# Altium project SCH-46441_A1.PrjPcb
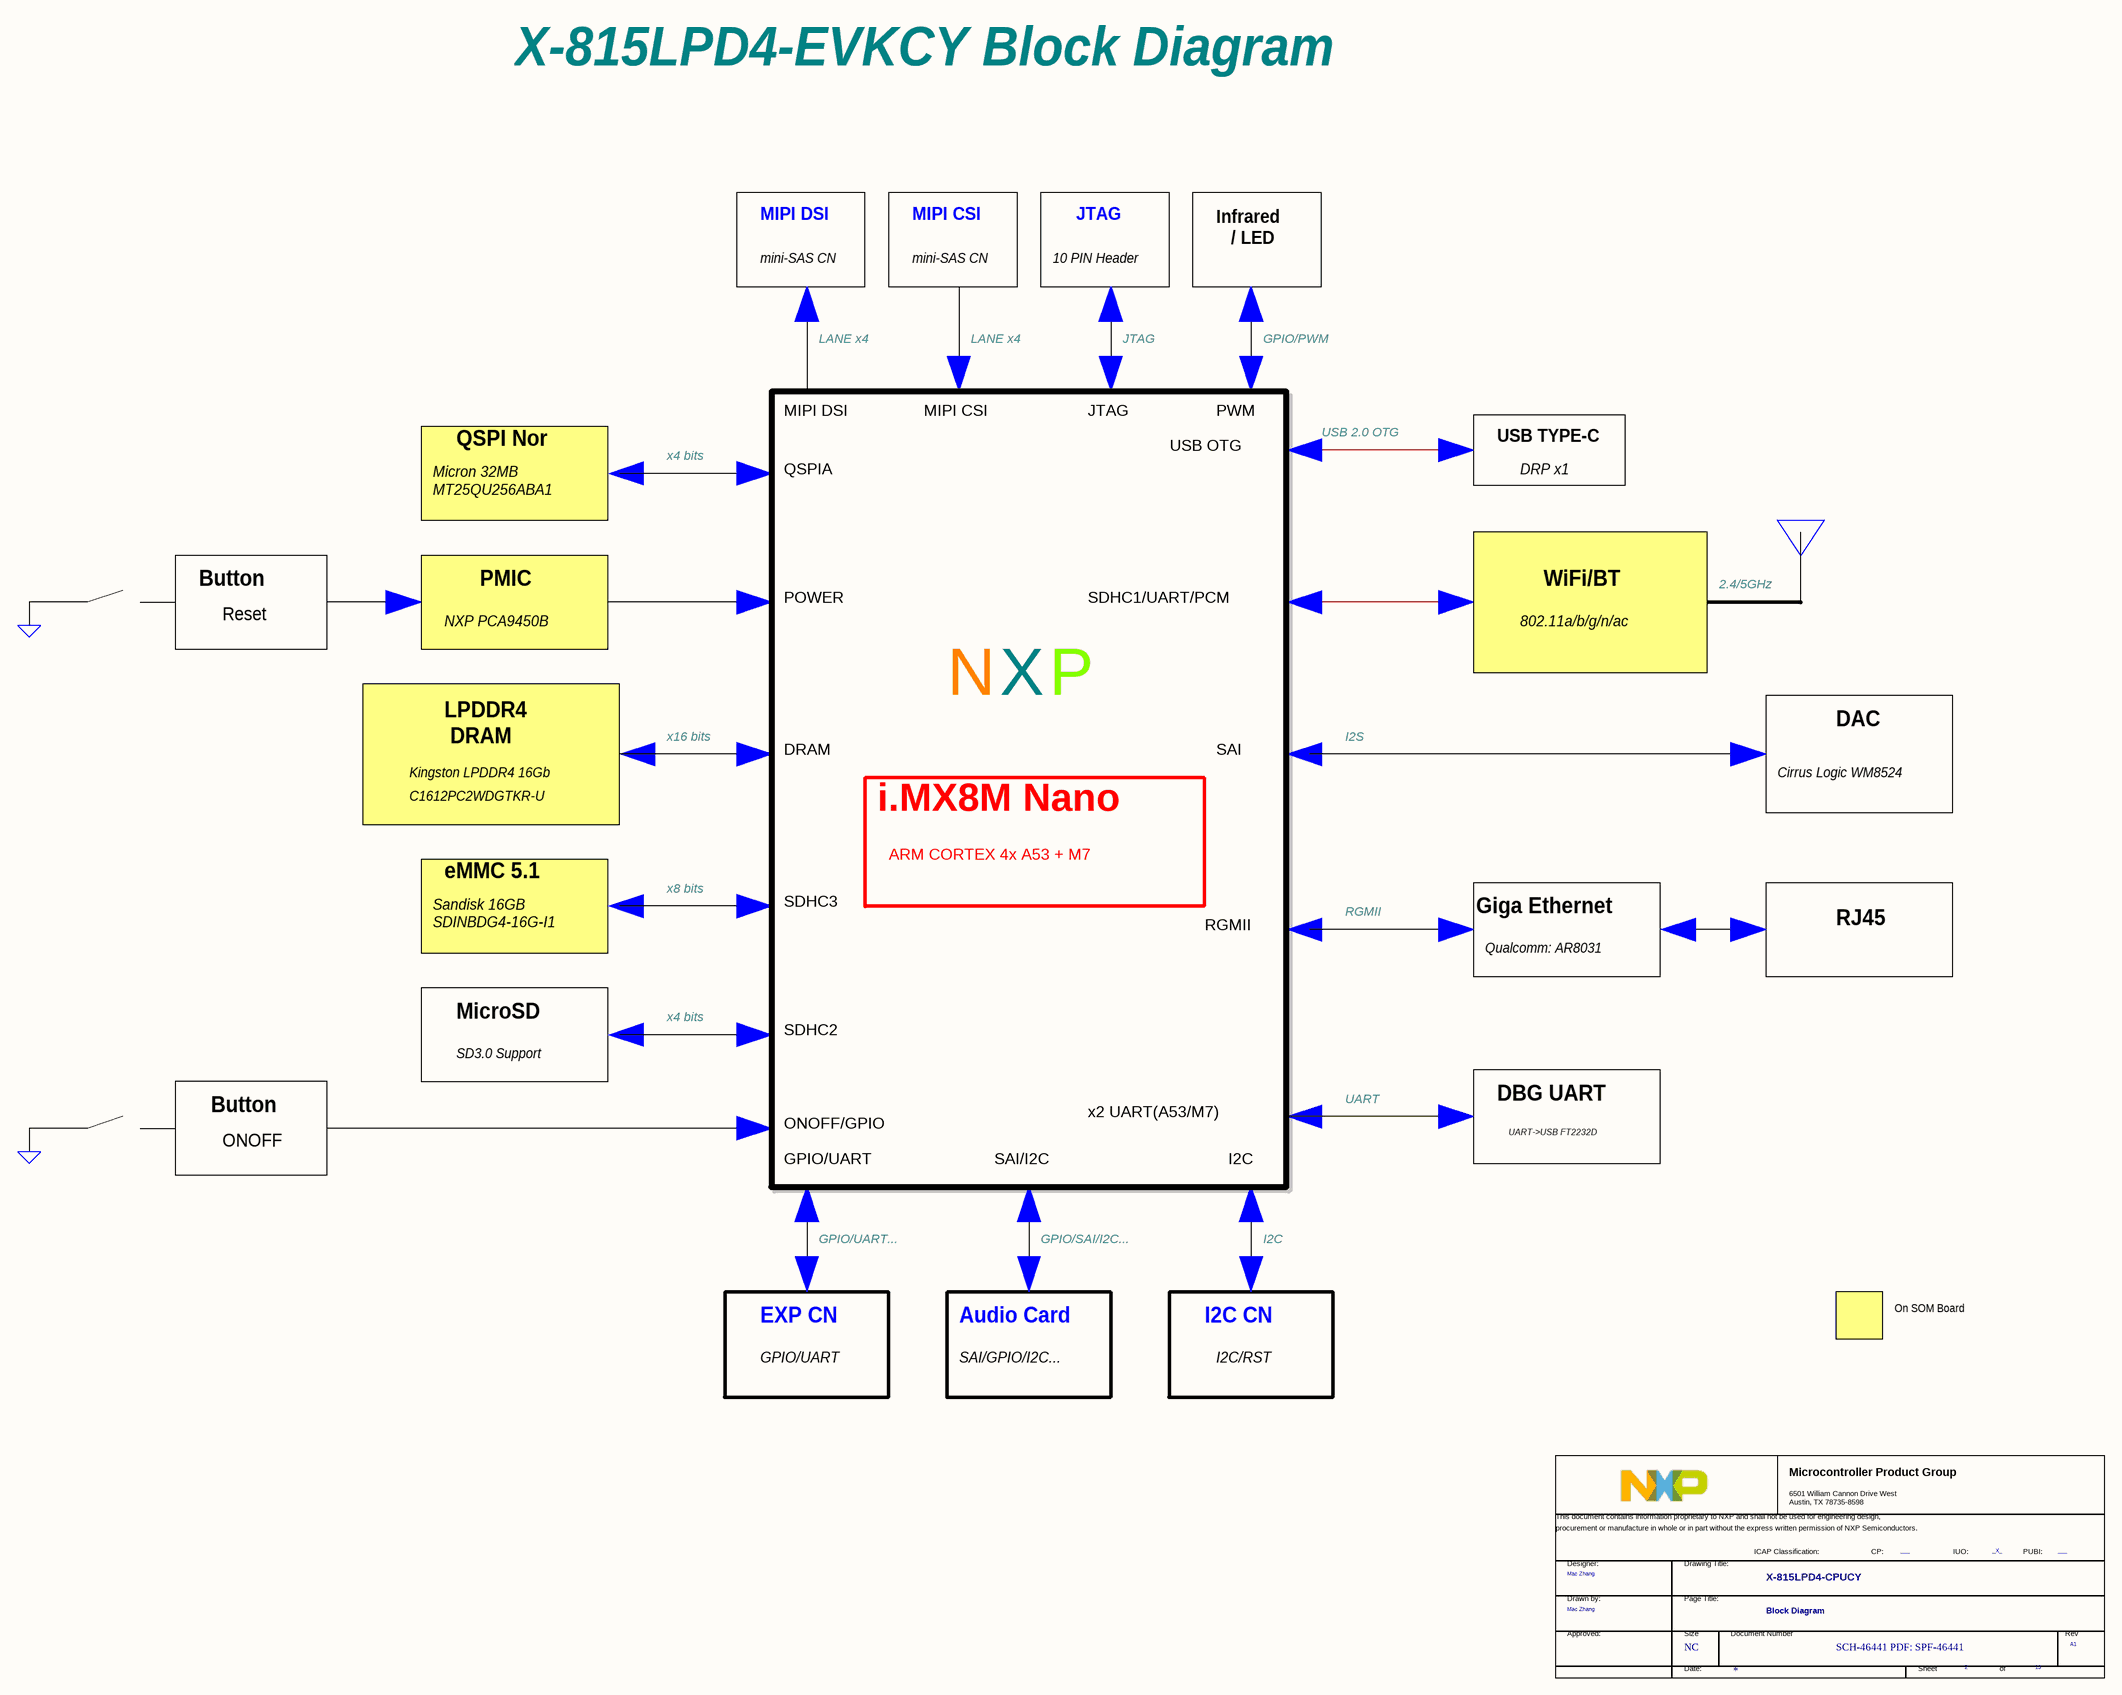
[diagram p0: Page02 BLOCK DIAGRAM.SchDoc]
5 sheets, 124 parts. Net scope: global (net labels, ports and power ports of the same name join across sheets).
Sheets:
  Page02 BLOCK DIAGRAM.SchDoc
  Page03 PWR TREE.SchDoc
  Page10 WIFI&Bluetooth.SchDoc
  Page12 PMIC PCA9450B.SchDoc
  Page09 eMMC_QSPI.SchDoc

## Sheet Page02 BLOCK DIAGRAM.SchDoc
size 513 x 386 mm

### Parts
(Parts that share a designator on the sheet are numbered #1, #2 ... from top to bottom, then left to right.)
*#1  Doc: SCH-46441 PDF: SPF-46441  RevCode: A1  Title: X-815LPD4-CPUCY  Page Size: NC  Page Number: 2  Page Count: 13  PageTitle: Block Diagram  Designer: Mac Zhang  PUBI: ___  FIUO: _X_  (hidden comment: TitleBlock_MCPG)  (graphical)

### Notes on the sheet
- X-815LPD4-EVKCY Block Diagram
- MIPI DSI
- MIPI CSI
- JTAG
- Infrared
  / LED
- mini-SAS CN
- 10 PIN Header
- LANE x4
- GPIO/PWM
- PWM
- QSPI Nor
- x4 bits
- QSPIA
- USB OTG
- USB 2.0 OTG
- USB TYPE-C
- DRP x1
- Micron 32MB
  MT25QU256ABA1
- Button
- PMIC
- WiFi/BT
- 2.4/5GHz
- Reset
- NXP PCA9450B
- POWER
- SDHC1/UART/PCM
- 802.11a/b/g/n/ac
- N
- X
- P
- Kingston LPDDR4 16Gb
- LPDDR4
  DRAM
- x16 bits
- DRAM
- SAI
- I2S
- Cirrus Logic WM8524
- DAC
- C1612PC2WDGTKR-U
- i.MX8M Nano
- eMMC 5.1
- x8 bits
- ARM CORTEX 4x A53 + M7
- Sandisk 16GB
  SDINBDG4-16G-I1
- SDHC3
- RGMII
- Giga Ethernet
- Qualcomm: AR8031
- RJ45
- SD3.0 Support
- MicroSD
- SDHC2
- ONOFF/GPIO
- x2 UART(A53/M7)
- UART
- DBG UART
- ONOFF
- GPIO/UART
- SAI/I2C
- I2C
- UART->USB FT2232D
- GPIO/UART...
- GPIO/SAI/I2C...
- EXP CN
- Audio Card
- SAI/GPIO/I2C...
- I2C CN
- I2C/RST
- On SOM Board
- (in symbol TitleBlock_MCPG) Microcontroller Product Group; 6501 William Cannon Drive West / Austin, TX 78735-8598; This document contains information proprietary to NXP and shall not be used for engineering design,; procurement or manufacture in whole or in part without the express written permission of NXP Semiconductors.; ICAP Classification:; CP:; IUO:; PUBI:; Designer:; Drawing Title:; Drawn by:; Page Title:; Approved:; Size; Document Number; Rev; Date:; Sheet; of

### Library data of the parts
*#1 = TitleBlock_MCPG: OrgAddr1: NO. 192 Liangjing Rd. Pudong New Area, ShangHai; OrgName: NXP Semiconductor; Page Create Date: March  8, 1995; DrawnBy: Mac Zhang; FCP: ___; Page Modify Date: *

## Sheet Page03 PWR TREE.SchDoc
size 513 x 386 mm
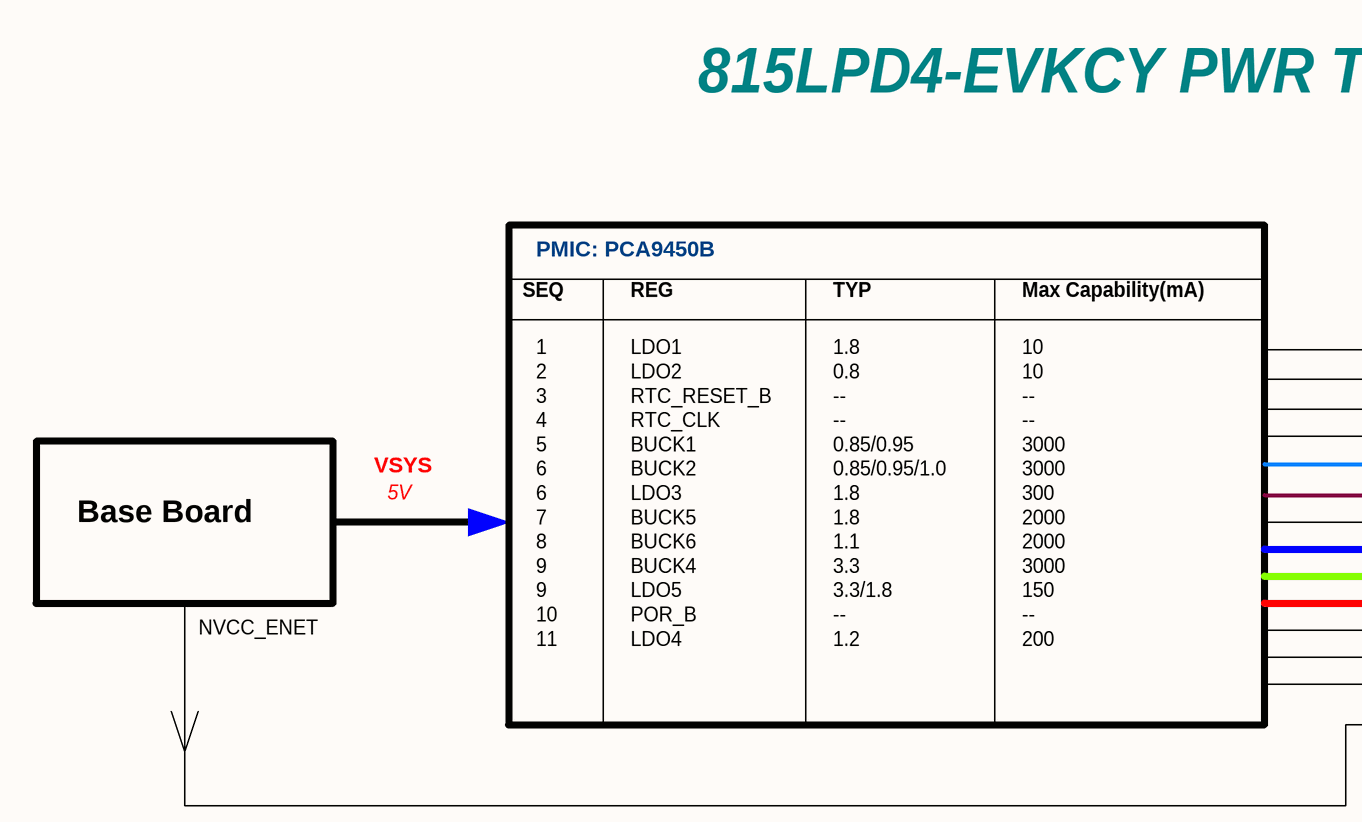
[diagram p1: Page03 PWR TREE.SchDoc, left]
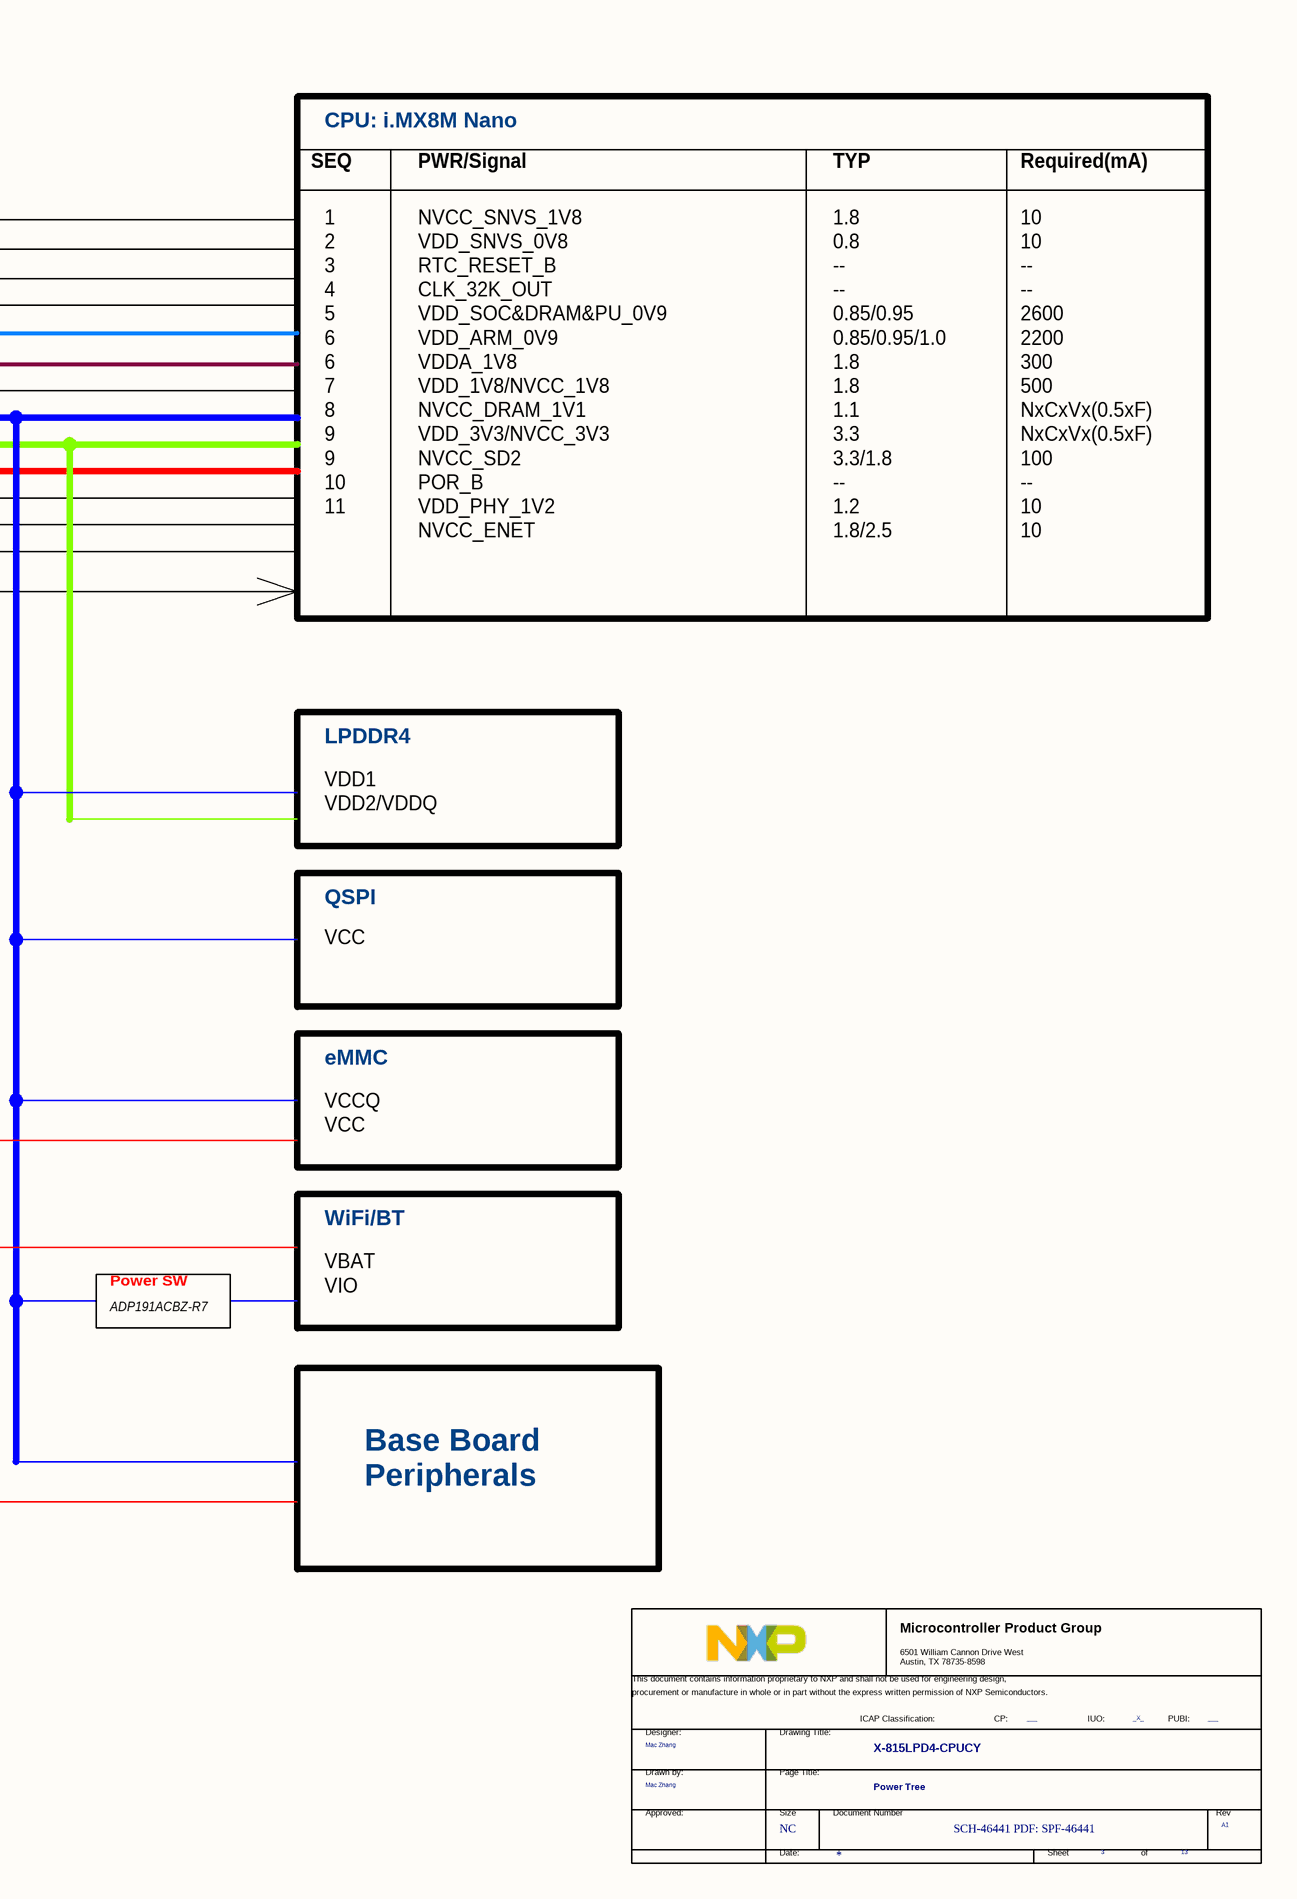
[diagram p2: Page03 PWR TREE.SchDoc, right]

### Parts
(Parts that share a designator on the sheet are numbered #1, #2 ... from top to bottom, then left to right.)
*#2  Doc: SCH-46441 PDF: SPF-46441  RevCode: A1  Title: X-815LPD4-CPUCY  Page Size: NC  Page Number: 3  Page Count: 13  PageTitle: Power Tree  Designer: Mac Zhang  PUBI: ___  FIUO: _X_  (hidden comment: TitleBlock_MCPG)  (graphical)

### Notes on the sheet
- 815LPD4-EVKCY PWR TREE
- PMIC: PCA9450B
- CPU: i.MX8M Nano
- SEQ
- REG
- TYP
- Max Capability(mA)
- PWR/Signal
- Required(mA)
- VSYS
- Base Board
- 5V
- NVCC_ENET
- 1
  2
  3
  4
  5
  6
  6
  7
  8
  9
  9
  10
  11
- LDO1
  LDO2
  RTC_RESET_B
  RTC_CLK
  BUCK1
  BUCK2
  LDO3
  BUCK5
  BUCK6
  BUCK4
  LDO5
  POR_B
  LDO4
- 1.8
  0.8
  --
  --
  0.85/0.95
  0.85/0.95/1.0
  1.8
  1.8
  1.1
  3.3
  3.3/1.8
  --
  1.2
- 10
  10
  --
  --
  3000
  3000
  300
  2000
  2000
  3000
  150
  --
  200
- NVCC_SNVS_1V8
  VDD_SNVS_0V8
  RTC_RESET_B
  CLK_32K_OUT
  VDD_SOC&DRAM&PU_0V9
  VDD_ARM_0V9
  VDDA_1V8
  VDD_1V8/NVCC_1V8
  NVCC_DRAM_1V1
  VDD_3V3/NVCC_3V3
  NVCC_SD2
  POR_B
  VDD_PHY_1V2
  NVCC_ENET
- 1.8
  0.8
  --
  --
  0.85/0.95
  0.85/0.95/1.0
  1.8
  1.8
  1.1
  3.3
  3.3/1.8
  --
  1.2
  1.8/2.5
- 10
  10
  --
  --
  2600
  2200
  300
  500
  NxCxVx(0.5xF)
  NxCxVx(0.5xF)
  100
  --
  10
  10
- LPDDR4
- VDD1
  VDD2/VDDQ
- VCC
- QSPI
- eMMC
- VCCQ
  VCC
- WiFi/BT
- Power SW
- VBAT
  VIO
- ADP191ACBZ-R7
- Base Board
  Peripherals
- (in symbol TitleBlock_MCPG) Microcontroller Product Group; 6501 William Cannon Drive West / Austin, TX 78735-8598; This document contains information proprietary to NXP and shall not be used for engineering design,; procurement or manufacture in whole or in part without the express written permission of NXP Semiconductors.; ICAP Classification:; CP:; IUO:; PUBI:; Designer:; Drawing Title:; Drawn by:; Page Title:; Approved:; Size; Document Number; Rev; Date:; Sheet; of

### Library data of the parts
*#2 = TitleBlock_MCPG: OrgName: NXP Semiconductor; OrgAddr1: NO. 192 Liangjing Rd. Pudong New Area, ShangHai; Page Create Date: March  8, 1995; DrawnBy: Mac Zhang; FCP: ___; Page Modify Date: *

## Sheet Page10 WIFI&Bluetooth.SchDoc
size 386 x 246 mm
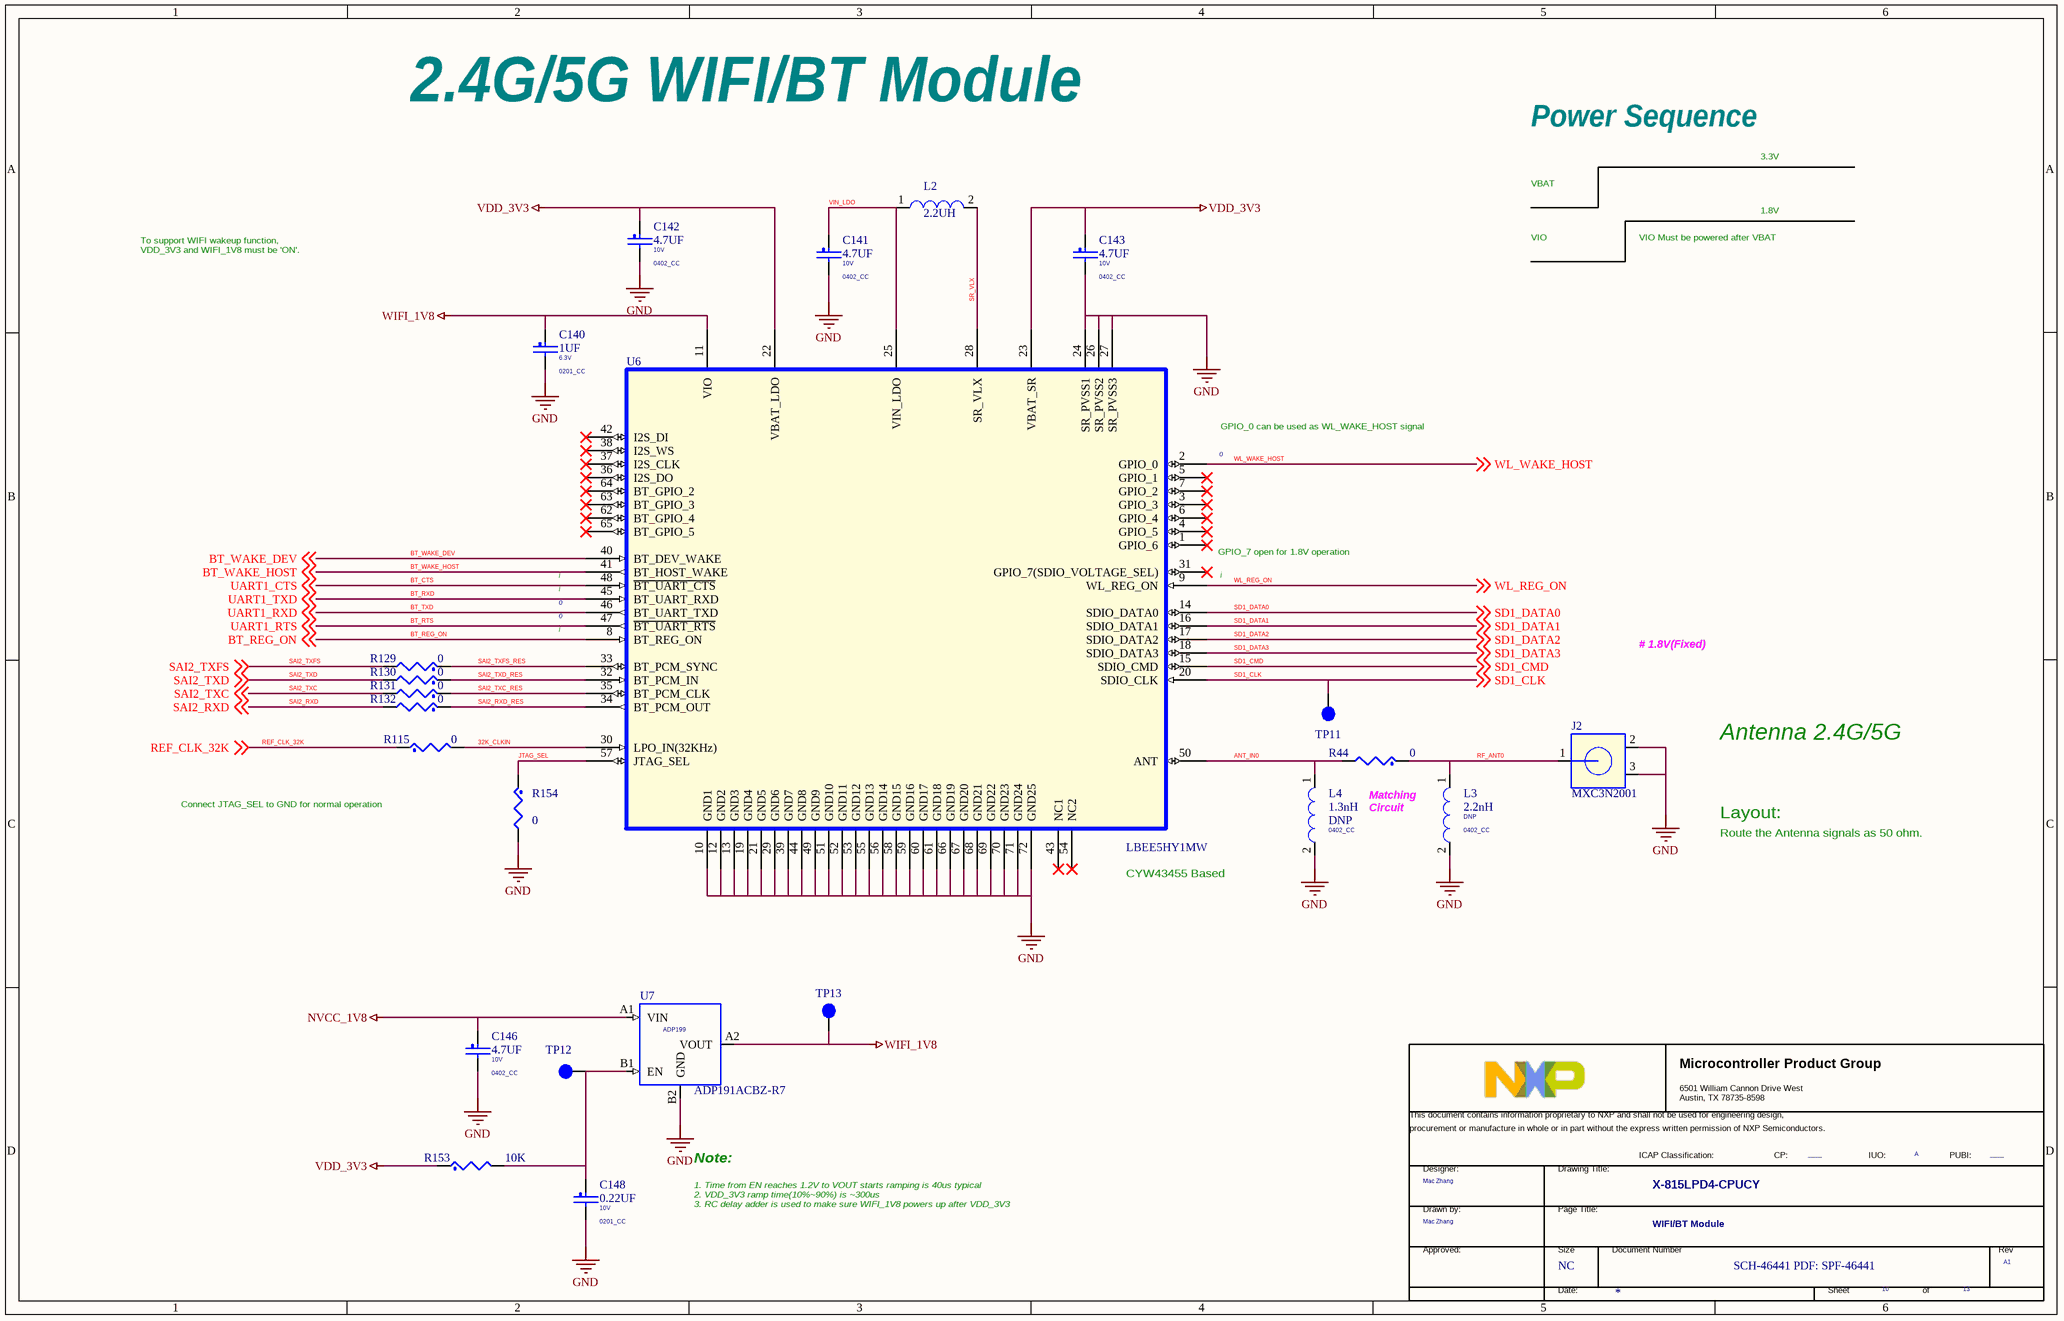
[diagram p3: Page10 WIFI&Bluetooth.SchDoc]

### Parts
(Parts that share a designator on the sheet are numbered #1, #2 ... from top to bottom, then left to right.)
*#3  Doc: SCH-46441 PDF: SPF-46441  RevCode: A1  Title: X-815LPD4-CPUCY  Page Size: NC  Page Number: 10  Page Count: 13  PageTitle: WIFI/BT Module  Designer: Mac Zhang  PUBI: ____  FIUO: A  (hidden comment: TitleBlock_MCPG)  (graphical)
C140  1UF  VOLTAGE: 6.3V  [0201_CC]
C141  4.7UF  VOLTAGE: 10V  [0402_CC]
C142  4.7UF  VOLTAGE: 10V  [0402_CC]
C143  4.7UF  VOLTAGE: 10V  [0402_CC]
C146  4.7UF  VOLTAGE: 10V  [0402_CC]
C148  0.22UF  VOLTAGE: 10V  [0201_CC]
J2  MXC3N2001  [CON_3_UFL_R_SMT]
L2  2.2UH  [IND_0603A]
L3  2.2nH  ASSY_OPT: DNP  [0402_CC]
L4  1.3nH  ASSY_OPT: DNP  [0402_CC]
R44  0  [0402_CC]
R115  0  [0402_CC]
R129  0  [0402_CC]
R130  0  [0402_CC]
R131  0  [0402_CC]
R132  0  [0402_CC]
R153  10K  [0201_CC]
R154  0  [0402_CC]
TP11  TPAD_015  [TPAD_015]  (value not drawn)
TP12  tpad_020  [tpad_020]  (value not drawn)
TP13  tpad_020  [tpad_020]  (value not drawn)
U6  LBEE5HY1MW  [lga72_0p5_7p9x7p3]
U7  ADP191ACBZ-R7  [wlcsp4_0p4_0p8x0p8_smdp]

### Nets
GND: C140.2 C141.2 C142.2 C143.2 C146.2 C148.2 J2.2(GND1) J2.3(GND2) L3.2 L4.2 R154.2 U6.10(GND1) U6.12(GND2) U6.13(GND3) U6.19(GND4) U6.21(GND5) U6.24(SR_PVSS1) U6.26(SR_PVSS2) U6.27(SR_PVSS3) U6.29(GND6) U6.39(GND7) U6.44(GND8) U6.49(GND9) U6.51(GND10) U6.52(GND11) U6.53(GND12) U6.55(GND13) U6.56(GND14) U6.58(GND15) U6.59(GND16) U6.60(GND17) U6.61(GND18) U6.66(GND19) U6.67(GND20) U6.68(GND21) U6.69(GND22) U6.70(GND23) U6.71(GND24) U6.72(GND25) U7.B2(GND)
NVCC_1V8: C146.1 U7.A1(VIN)
VDD_3V3: C142.1 C143.1 R153.1 U6.22(VBAT_LDO) U6.23(VBAT_SR)
WIFI_1V8: C140.1 TP13.1(Pin1) U6.11(VIO) U7.A2(VOUT)
32K_CLKIN: R115.2 U6.30(LPO_IN(32KHz))
ANT_IN0: L4.1 R44.2 U6.50(ANT)
BT_CTS: U6.48(~{BT_UART_CTS}) ; off-sheet UART1_CTS  [also labelled UART1_CTS]
BT_REG_ON: U6.8(BT_REG_ON) ; off-sheet BT_REG_ON
BT_RTS: U6.47(~{BT_UART_RTS}) ; off-sheet UART1_RTS  [also labelled UART1_RTS]
BT_RXD: U6.45(BT_UART_RXD) ; off-sheet UART1_TXD  [also labelled UART1_TXD]
BT_TXD: U6.46(BT_UART_TXD) ; off-sheet UART1_RXD  [also labelled UART1_RXD]
BT_WAKE_DEV: U6.40(BT_DEV_WAKE) ; off-sheet BT_WAKE_DEV
BT_WAKE_HOST: U6.41(BT_HOST_WAKE) ; off-sheet BT_WAKE_HOST
JTAG_SEL: R154.1 U6.57(JTAG_SEL)
REF_CLK_32K: R115.1 ; off-sheet REF_CLK_32K
RF_ANT0: J2.1(CTR) L3.1 R44.1
SAI2_RXD: R132.2 ; off-sheet SAI2_RXD
SAI2_RXD_RES: R132.1 U6.34(BT_PCM_OUT)
SAI2_TXC: R131.2 ; off-sheet SAI2_TXC
SAI2_TXC_RES: R131.1 U6.35(BT_PCM_CLK)
SAI2_TXD: R130.2 ; off-sheet SAI2_TXD
SAI2_TXD_RES: R130.1 U6.32(BT_PCM_IN)
SAI2_TXFS: R129.2 ; off-sheet SAI2_TXFS
SAI2_TXFS_RES: R129.1 U6.33(BT_PCM_SYNC)
SD1_CLK: TP11.1(Pin1) U6.20(SDIO_CLK) ; off-sheet SD1_CLK
SD1_CMD: U6.15(SDIO_CMD) ; off-sheet SD1_CMD
SD1_DATA0: U6.14(SDIO_DATA0) ; off-sheet SD1_DATA0
SD1_DATA1: U6.16(SDIO_DATA1) ; off-sheet SD1_DATA1
SD1_DATA2: U6.17(SDIO_DATA2) ; off-sheet SD1_DATA2
SD1_DATA3: U6.18(SDIO_DATA3) ; off-sheet SD1_DATA3
SR_VLX: L2.2 U6.28(SR_VLX)
VIN_LDO: C141.1 L2.1 U6.25(VIN_LDO)
WL_REG_ON: U6.9(WL_REG_ON) ; off-sheet WL_REG_ON
WL_WAKE_HOST: U6.2(GPIO_0) ; off-sheet WL_WAKE_HOST
NetC148_1: C148.1 R153.2 TP12.1(Pin1) U7.B1(EN)

Not connected (* = marked no-connect by the designer): U6 1(GPIO_6)* 3(GPIO_3)* 4(GPIO_5)* 5(GPIO_1)* 6(GPIO_4)* 7(GPIO_2)* 31(GPIO_7(SDIO_VOLTAGE_SEL))* 36(I2S_DO)* 37(I2S_CLK)* 38(I2S_WS)* 42(I2S_DI)* 43(NC1)* 54(NC2)* 62(BT_GPIO_4)* 63(BT_GPIO_3)* 64(BT_GPIO_2)* 65(BT_GPIO_5)*

### Notes on the sheet
- 2.4G/5G WIFI/BT Module
- VBAT
- Power Sequence
- 3.3V
- To support WIFI wakeup function,
  VDD_3V3 and WIFI_1V8 must be 'ON'.
- VIO
- VIO Must be powered after VBAT
- 1.8V
- (near U6) o
- GPIO_0 can be used as WL_WAKE_HOST signal
- i
- (near U6) GPIO_7 open for 1.8V operation
- o
- # 1.8V(Fixed)
- (near L3) Matching
  Circuit
- Antenna 2.4G/5G
- Layout:
- Connect JTAG_SEL to GND for normal operation
- Route the Antenna signals as 50 ohm.
- (near U6) CYW43455 Based
- 1. Time from EN reaches 1.2V to VOUT starts ramping is 40us typical
  2. VDD_3V3 ramp time(10%~90%) is ~300us
  3. RC delay adder is used to make sure WIFI_1V8 powers up after VDD_3V3
- Note:
- (in symbol ADP199_4P) ADP199
- (in symbol TitleBlock_MCPG) Microcontroller Product Group; 6501 William Cannon Drive West / Austin, TX 78735-8598; This document contains information proprietary to NXP and shall not be used for engineering design,; procurement or manufacture in whole or in part without the express written permission of NXP Semiconductors.; ICAP Classification:; CP:; IUO:; PUBI:; Designer:; Drawing Title:; Drawn by:; Page Title:; Approved:; Size; Document Number; Rev; Date:; Sheet; of

### Library data of the parts
*#3 = TitleBlock_MCPG: as *#2 on sheet Page03 PWR TREE; Page Create Date: March  8, 1995; DrawnBy: Mac Zhang; FCP: ____; Page Modify Date: *
C140 = CAP_NP: CAP CER 1uF 6.3V 20% X5R 0201; CLASS: DISCRETE; FPLIST: CC0201,CC0201_HD,0201_CC,0201_CC_012SM_NSP; CAD_APPROVED: Yes; MFG_PN01: 02016D105MAT2A; MFG_NAME01: AVX; AGILE_PN: 150-79407; HEIGHT: 0.35MM; ROHS: Yes; Tolerance: 20%; PCB Footprint: 0201_CC; Package Size: 0201; Package Type: 7¡± reel
C141-C143 C146 = CAP_NP: CAP CER 4.7uF 10V 10% X5R 0402; CLASS: DISCRETE; AGILE_PN: 150-80044; MFG_NAME01: Samsung Electro Mechanics; MFG_PN01: CL05A475KP5NRNC; CAD_APPROVED: Yes; FPLIST: CC0402_25,CC0402_HD,0402_CC; Tolerance: 10%; ROHS: Yes; HEIGHT: 0.65MM; PCB Footprint: 0402_CC
C148 = CAP_NP: CAP CER 0.22UF 10V 20% X5R 0201; CLASS: DISCRETE; AGILE_PN: 150-78815; MFG_NAME01: Taiyo Yuden; MFG_PN01: LMK063BJ224MP-F; CAD_APPROVED: Yes; FPLIST: CC0201,CC0201_HD,0201_CC; Tolerance: 20%; ROHS: Yes; HEIGHT: 0.33MM; PCB Footprint: 0201_CC
J2 = UFL: CON 1 COAX SKT SMT 55H AU; CLASS: IO; AGILE_PN: 211-79898; MFG_NAME01: SHENZHEN ATOM TECHNOLOGY CO.,LTD; CAD_APPROVED: Yes; MFG_PN01: MXC3N2001; ROHS: Yes; HEIGHT: 1.4MM; PCB Footprint: CON_3_UFL_R_SMT
L2 = INDUCTOR: IND -- 2.2UH@1MHZ 1.05A 20% 0603; CLASS: DISCRETE; AGILE_PN: 180-78587; MFG_NAME01: MURATA; MFG_PN01: LQM18PN2R2MGH; Temp_Range: -40C to + 85C; CAD_APPROVED: Yes; FPLIST: IND_0603A,0603_CC; PCB Footprint: IND_0603A; Tolerance: 20%; ROHS: Yes; HEIGHT: 1MM; PART_TYPE: INDUCTOR; Temp Range: -40C to + 85C
L3 = INDUCTOR: IND -- 0.0022UH@100MHZ 300MA 0.0003UH 0402; CLASS: DISCRETE; FPLIST: IND_0402,0402_CC; CAD_APPROVED: Yes; MFG_PN01: LQG15HS2N2S02D; MFG_NAME01: MURATA; AGILE_PN: 180-76426; PCB Footprint: 0402_CC; PART_TYPE: INDUCTOR; HEIGHT: 0.55mm; ROHS: Yes; Tolerance: 0.0003UH; Package Size: 0402
L4 = IND: IND FILM RF 1.3nH@500MHz  280mA 0.1nH 0402; PART_TYPE: INDUCTOR\0402; CLASS: DISCRETE; FPLIST: IND_0402,0402_CC; CAD_APPROVED: Yes; MFG_PN01: LQP15MN1N3B02D; MFG_NAME01: MURATA; AGILE_PN: 180-78445; PCB Footprint: 0402_CC; HEIGHT: 0.45MM; ROHS: Yes; Tolerance: 0.1nH; Package Size: 0402
R44 R115 = RES: RES MF ZERO OHM 1/16W 5% 0402; CLASS: DISCRETE; AGILE_PN: 470-75394; MFG_NAME01: ROHM; MFG_PN01: MCR01MZPJ000; CAD_APPROVED: Yes; HEIGHT: 0.45 MM; Tolerance: 5%; ROHS: Yes; PCB Footprint: 0402_CC; VOLTAGE: 1/16W
R129-R131 = RES: RES MF ZERO OHM 1/16W 5% 0402; CLASS: DISCRETE; AGILE_PN: 470-75394; MFG_NAME01: ROHM; MFG_PN01: MCR01MZPJ000; CAD_APPROVED: Yes; FPLIST: RC0402_25,RC0402_HD,RC0402_X2,0402_CC; TOL: 1%; SIGNAL_MODEL: DEFAULT_RESISTOR_10000OHM_2_1; PCB Footprint: 0402_CC; Tolerance: 5%; ROHS: Yes; HEIGHT: 0.45 MM; VOLTAGE: 1/16W
R132 R154 = RES: RES MF ZERO OHM 1/16W 5% 0402; CLASS: DISCRETE; SIGNAL_MODEL: DEFAULT_RESISTOR_10000OHM_2_1; TOL: 1%; FPLIST: RC0402_25,RC0402_HD,RC0402_X2,0402_CC; CAD_APPROVED: Yes; MFG_PN01: MCR01MZPJ000; MFG_NAME01: ROHM; AGILE_PN: 470-75394; PCB Footprint: 0402_CC; HEIGHT: 0.45 MM; ROHS: Yes; Tolerance: 5%; VOLTAGE: 1/16W
R153 = RES: RES MF 10K 1/20W 5% 0201; CLASS: DISCRETE; FPLIST: RC0201,0201_CC; CAD_APPROVED: Yes; MFG_PN01: RTT01103JTH; MFG_NAME01: RALEC ELECTRONIC CORP; AGILE_PN: 470-79719; HEIGHT: 0.26 MM; ROHS: Yes; Tolerance: 5%; PCB Footprint: 0201_CC
TP11 = TESTLOOP: TEST POINT PAD 15MIL DIA SMT, NO PART TO ORDER; CLASS: IO; ASSY_OPT: DNP; AGILE_PN: 211-76645; MFG_NAME01: NOTACOMPONENT; CAD_APPROVED: Yes; MFG_PN01: NOTACOMPONENT; ROHS: Yes; HEIGHT: 0.1MM; PCB Footprint: TPAD_015
TP12 TP13 = TESTLOOP: TEST POINT PAD 0.5MM DIA SMT, NO PART TO ORDER; CLASS: IO; CAD_APPROVED: Yes; AGILE_PN: 211-77484; HEIGHT: 0.1MM; ROHS: Yes; PCB Footprint: tpad_020
U6 = LBEE5HY1MW_LGA72: IC XCVR WIFI BLUETOOTH MODULE A/B/G/N/AC 1.71-3.46V LGA72; CAD_APPROVED: Yes; PRE_APN: 312-82117; MFG_PN01: LBEE5HY1MW-TEMP; MFG_NAME01: MURATA; AGILE_PN: TMP-WF-34457; CLASS: IC; PCB Footprint: lga72_0p5_7p9x7p3; HEIGHT: 1.1MM; ROHS: Yes
U7 = ADP199_4P: IC HIGH SIDE PWR SW 1.1-3.6V WLCSP4; AGILE_PN: 315-82028; MFG_NAME01: ANALOG DEVICES; Temp_Range: -45 to 85 C; CAD_APPROVED: Yes; CLASS: IC; PCB Footprint: wlcsp4_0p4_0p8x0p8_smdp; MFG_PN01: ADP191ACBZ-R7; ROHS: Yes; HEIGHT: 0.66MM; VOLTAGE: 1.1-3.6V; Temp Range: -45 to 85 C

## Sheet Page12 PMIC PCA9450B.SchDoc
size 513 x 386 mm
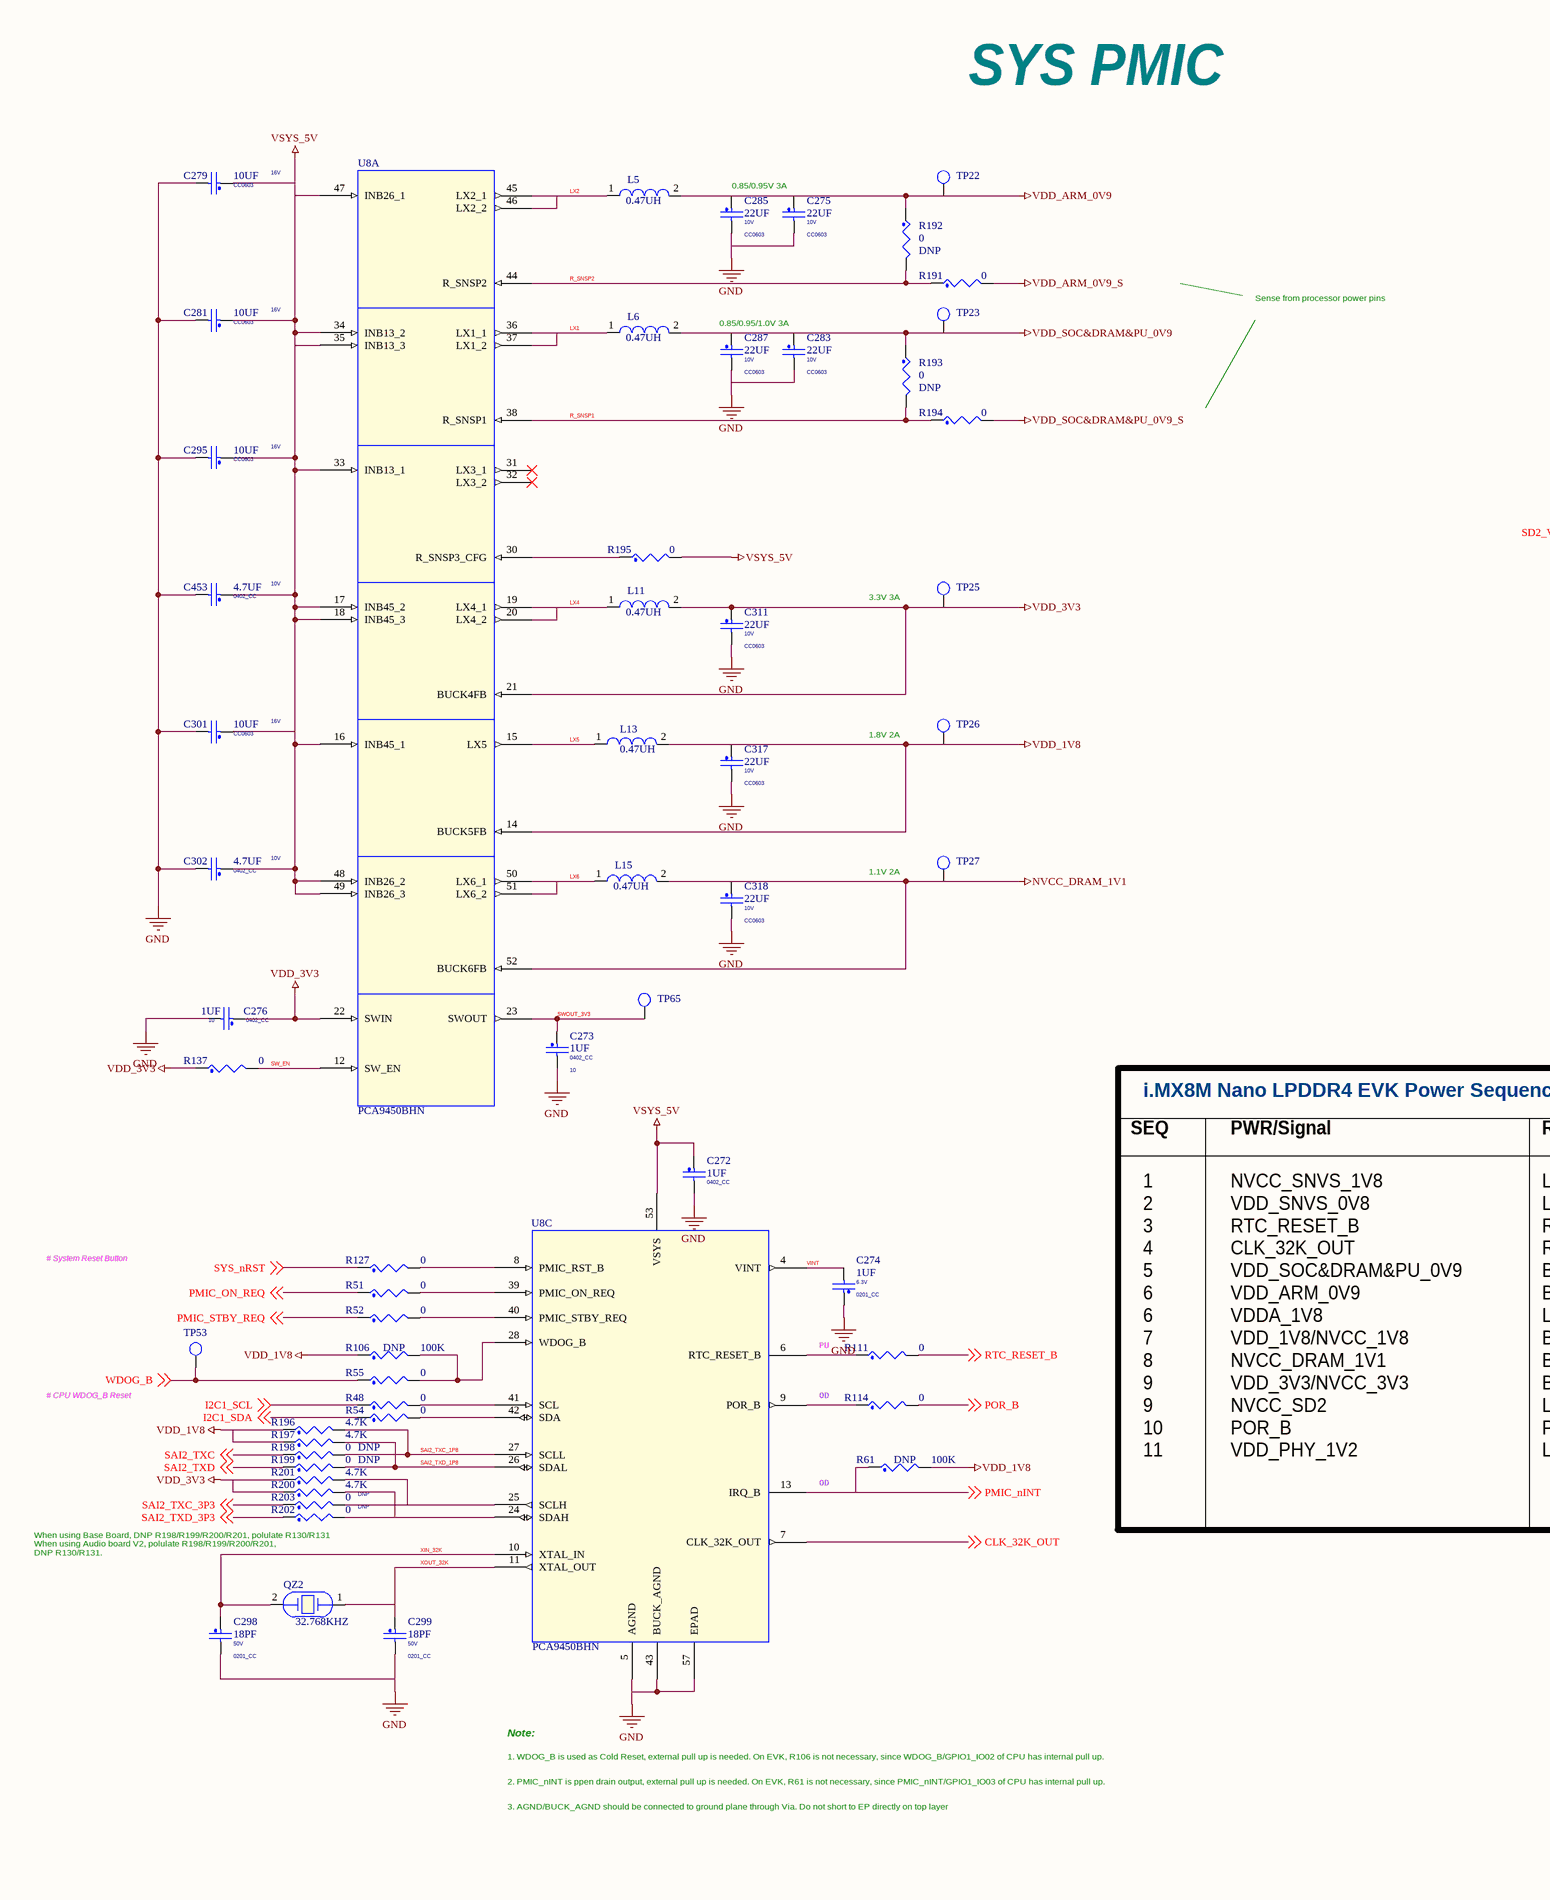
[diagram p4: Page12 PMIC PCA9450B.SchDoc, left]
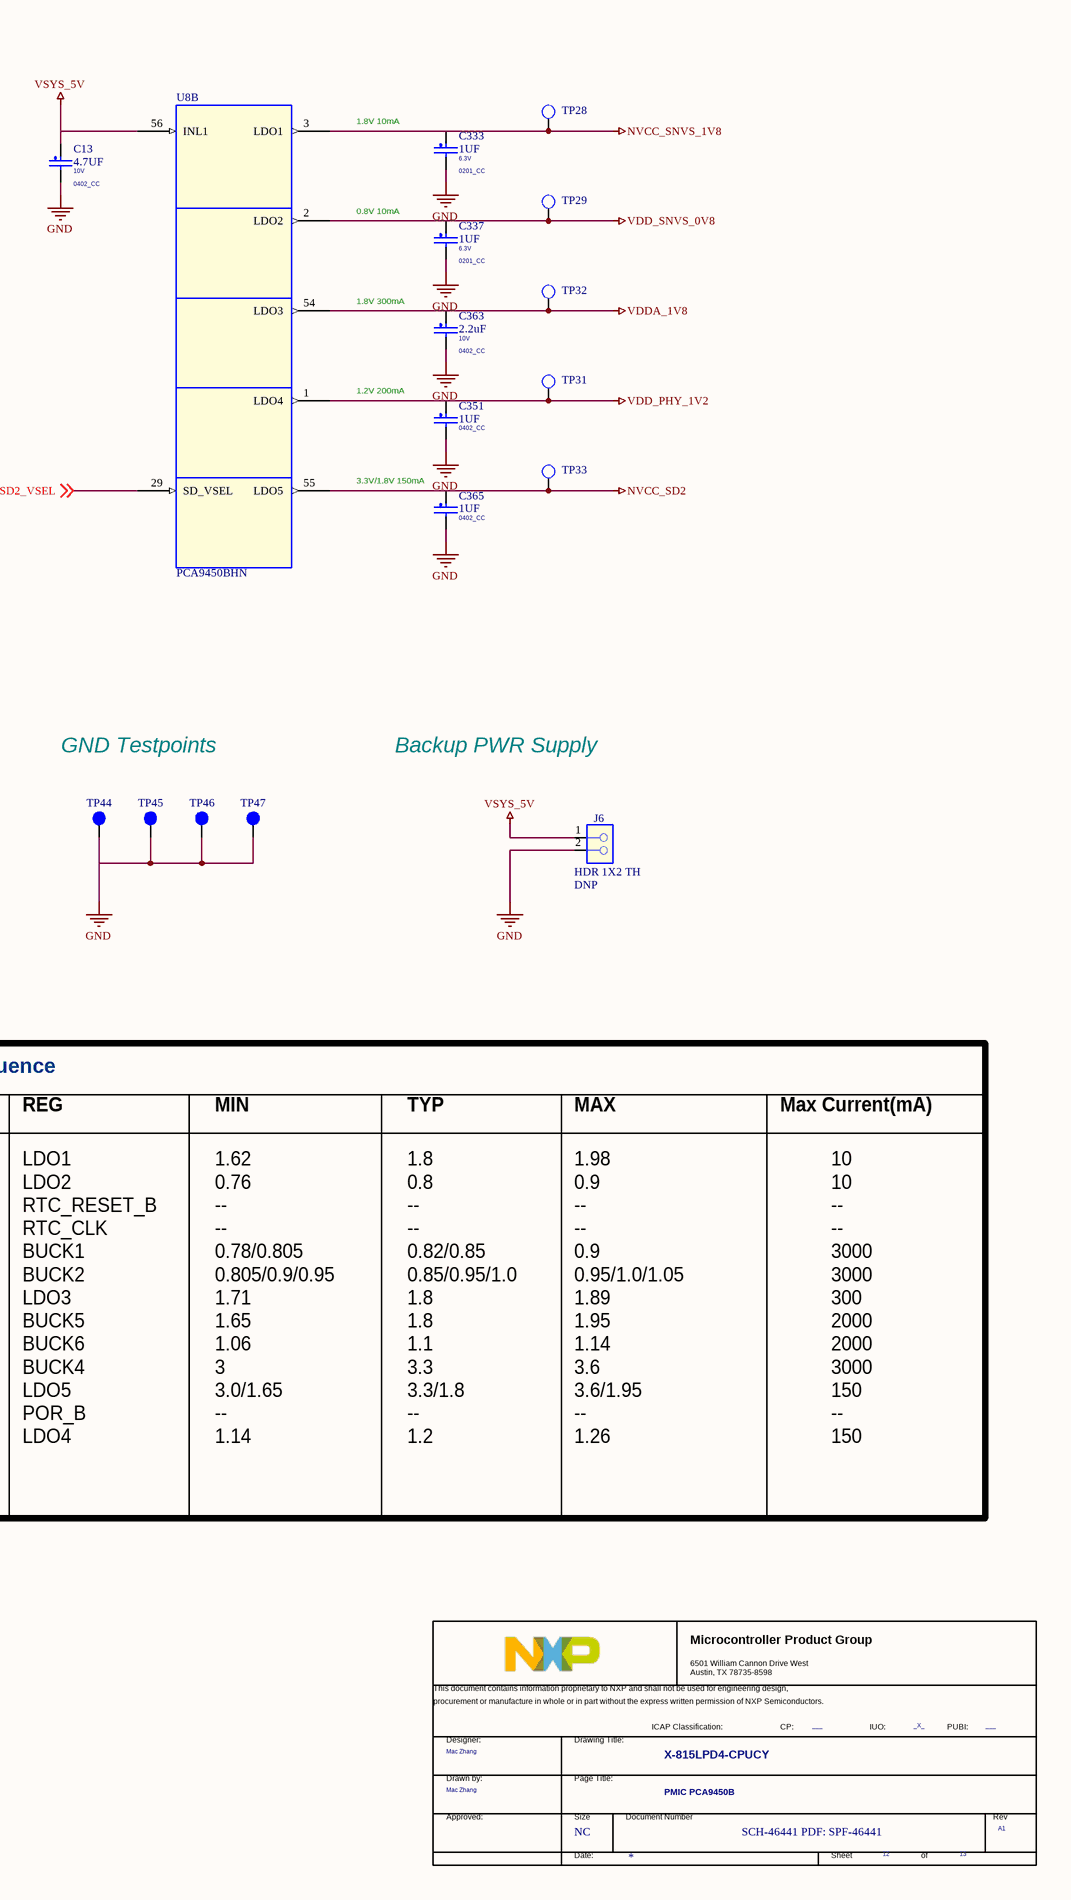
[diagram p5: Page12 PMIC PCA9450B.SchDoc, right]

### Parts
(Parts that share a designator on the sheet are numbered #1, #2 ... from top to bottom, then left to right.)
*#4  Doc: SCH-46441 PDF: SPF-46441  RevCode: A1  Title: X-815LPD4-CPUCY  Page Size: NC  Page Number: 12  Page Count: 13  PageTitle: PMIC PCA9450B  Designer: Mac Zhang  PUBI: ___  FIUO: _X_  (hidden comment: TitleBlock_MCPG)  (graphical)
C13  4.7UF  VOLTAGE: 10V  [0402_CC]
C272  1UF  [0402_CC]
C273  1UF  VOLTAGE: 10  [0402_CC]
C274  1UF  VOLTAGE: 6.3V  [0201_CC]
C275  22UF  VOLTAGE: 10V  [CC0603]
C276  1UF  VOLTAGE: 10  [0402_CC]
C279  10UF  VOLTAGE: 16V  [CC0603]
C281  10UF  VOLTAGE: 16V  [CC0603]
C283  22UF  VOLTAGE: 10V  [CC0603]
C285  22UF  VOLTAGE: 10V  [CC0603]
C287  22UF  VOLTAGE: 10V  [CC0603]
C295  10UF  VOLTAGE: 16V  [CC0603]
C298  18PF  VOLTAGE: 50V  [0201_CC]
C299  18PF  VOLTAGE: 50V  [0201_CC]
C301  10UF  VOLTAGE: 16V  [CC0603]
C302  4.7UF  VOLTAGE: 10V  [0402_CC]
C311  22UF  VOLTAGE: 10V  [CC0603]
C317  22UF  VOLTAGE: 10V  [CC0603]
C318  22UF  VOLTAGE: 10V  [CC0603]
C333  1UF  VOLTAGE: 6.3V  [0201_CC]
C337  1UF  VOLTAGE: 6.3V  [0201_CC]
C351  1UF  [0402_CC]
C363  2.2uF  VOLTAGE: 10V  [0402_CC]
C365  1UF  [0402_CC]
C453  4.7UF  VOLTAGE: 10V  [0402_CC]
J6  HDR 1X2 TH  ASSY_OPT: DNP  [HDR_1X2]
L5  0.47UH  [ind_sph2520]
L6  0.47UH  [ind_sph2520]
L11  0.47UH  [ind_sph2520]
L13  0.47UH  [IND_2016A]
L15  0.47UH  [ind_sph2520]
QZ2  32.768KHZ  [XTAL2-3P2X1P5-SM]
R48  0  [0402_CC]
R51  0  [0402_CC]
R52  0  [0402_CC]
R54  0  [0402_CC]
R55  0  [0402_CC]
R61  100K  ASSY_OPT: DNP  [0201_CC]
R106  100K  ASSY_OPT: DNP  [0201_CC]
R111  0  [0402_CC]
R114  0  [0402_CC]
R127  0  [0402_CC]
R137  0  [0402_CC]
R191  0  [0402_CC]
R192  0  ASSY_OPT: DNP  [0402_CC]
R193  0  ASSY_OPT: DNP  [0402_CC]
R194  0  [0402_CC]
R195  0  [0402_CC]
R196  4.7K  [0201_CC]
R197  4.7K  [0201_CC]
R198  0  ASSY_OPT: DNP  [0402_CC]
R199  0  ASSY_OPT: DNP  [0402_CC]
R200  4.7K  [0201_CC]
R201  4.7K  [0201_CC]
R202  0  ASSY_OPT: DNP  [0402_CC]
R203  0  ASSY_OPT: DNP  [0402_CC]
TP22  TP_35MIL  [testpoint_35mil]  (value not drawn)
TP23  TP_35MIL  [testpoint_35mil]  (value not drawn)
TP25  TP_35MIL  [testpoint_35mil]  (value not drawn)
TP26  TP_35MIL  [testpoint_35mil]  (value not drawn)
TP27  TP_35MIL  [testpoint_35mil]  (value not drawn)
TP28  TP_35MIL  [testpoint_35mil]  (value not drawn)
TP29  TP_35MIL  [testpoint_35mil]  (value not drawn)
TP31  TP_35MIL  [testpoint_35mil]  (value not drawn)
TP32  TP_35MIL  [testpoint_35mil]  (value not drawn)
TP33  TP_35MIL  [testpoint_35mil]  (value not drawn)
TP44  TPAD_050  [TPAD_050]  (value not drawn)
TP45  TPAD_050  [TPAD_050]  (value not drawn)
TP46  TPAD_050  [TPAD_050]  (value not drawn)
TP47  TPAD_050  [TPAD_050]  (value not drawn)
TP53  TP_35MIL  [testpoint_35mil]  (value not drawn)
TP65  TP_35MIL  [testpoint_35mil]  (value not drawn)
U8  PCA9450BHN  [hvqfn56_0p4_7x7_ep4p7mm]  (parts A,B,C of 3)

### Nets
GND: C13.2 C272.2 C273.2 C274.1 C275.2 C276.2 C279.2 C281.2 C283.2 C285.2 C287.2 C295.2 C298.2 C299.2 C301.2 C302.2 C311.2 C317.2 C318.2 C333.2 C337.2 C351.2 C363.2 C365.2 C453.2 J6.2 TP44.1(Pin1) TP45.1(Pin1) TP46.1(Pin1) TP47.1(Pin1) U8.5(AGND) U8.43(BUCK_AGND) U8.57(EPAD)
NVCC_DRAM_1V1: C318.1 L15.2 TP27.1(TP) U8.52(BUCK6FB)
NVCC_SD2: C365.1 TP33.1(TP) U8.55(LDO5)
NVCC_SNVS_1V8: C333.1 TP28.1(TP) U8.3(LDO1)
VDD_1V8: C317.1 L13.2 R61.2 R106.1 R196.1 R197.1 TP26.1(TP) U8.14(BUCK5FB)
VDD_3V3: C276.1 C311.1 L11.2 R137.1 R200.1 R201.1 TP25.1(TP) U8.21(BUCK4FB) U8.22(SWIN)
VDD_ARM_0V9: C275.1 C285.1 L5.2 R192.1 TP22.1(TP)
VDD_ARM_0V9_S: R191.2
VDD_PHY_1V2: C351.1 TP31.1(TP) U8.1(LDO4)
VDD_SNVS_0V8: C337.1 TP29.1(TP) U8.2(LDO2)
VDD_SOC&DRAM&PU_0V9: C283.1 C287.1 L6.2 R193.1 TP23.1(TP)
VDD_SOC&DRAM&PU_0V9_S: R194.2
VDDA_1V8: C363.1 TP32.1(TP) U8.54(LDO3)
VSYS_5V: C13.1 C272.1 C279.1 C281.1 C295.1 C301.1 C302.1 C453.1 J6.1 R195.2 U8.16(INB45_1) U8.17(INB45_2) U8.18(INB45_3) U8.33(INB13_1) U8.34(INB13_2) U8.35(INB13_3) U8.47(INB26_1) U8.48(INB26_2) U8.49(INB26_3) U8.53(VSYS) U8.56(INL1)
CLK_32K_OUT: U8.7(CLK_32K_OUT) ; off-sheet CLK_32K_OUT
I2C1_SCL: R48.1 ; off-sheet I2C1_SCL
I2C1_SDA: R54.1 ; off-sheet I2C1_SDA
LX1: L6.1 U8.36(LX1_1) U8.37(LX1_2)
LX2: L5.1 U8.45(LX2_1) U8.46(LX2_2)
LX4: L11.1 U8.19(LX4_1) U8.20(LX4_2)
LX5: L13.1 U8.15(LX5)
LX6: L15.1 U8.50(LX6_1) U8.51(LX6_2)
PMIC_nINT: R61.1 U8.13(IRQ_B) ; off-sheet PMIC_nINT
PMIC_ON_REQ: R51.1 ; off-sheet PMIC_ON_REQ
PMIC_STBY_REQ: R52.1 ; off-sheet PMIC_STBY_REQ
POR_B: R114.2 ; off-sheet POR_B
R_SNSP1: R193.2 R194.1 U8.38(R_SNSP1)
R_SNSP2: R191.1 R192.2 U8.44(R_SNSP2)
RTC_RESET_B: R111.2 ; off-sheet RTC_RESET_B
SAI2_TXC: R198.1 ; off-sheet SAI2_TXC
SAI2_TXC_1P8: R196.2 R198.2 U8.27(SCLL)
SAI2_TXC_3P3: R203.1 ; off-sheet SAI2_TXC_3P3
SAI2_TXD: R199.1 ; off-sheet SAI2_TXD
SAI2_TXD_1P8: R197.2 R199.2 U8.26(SDAL)
SAI2_TXD_3P3: R202.1 ; off-sheet SAI2_TXD_3P3
SD2_VSEL: U8.29(SD_VSEL) ; off-sheet SD2_VSEL
SW_EN: R137.2 U8.12(SW_EN)
SWOUT_3V3: C273.1 TP65.1(TP) U8.23(SWOUT)
SYS_nRST: R127.1 ; off-sheet SYS_nRST
VINT: C274.2 U8.4(VINT)
WDOG_B: R55.1 TP53.1(TP) ; off-sheet WDOG_B
XIN_32K: C298.1 QZ2.2 U8.10(XTAL_IN)
XOUT_32K: C299.1 QZ2.1 U8.11(XTAL_OUT)
NetR48_2: R48.2 U8.41(SCL)
NetR51_2: R51.2 U8.39(PMIC_ON_REQ)
NetR52_2: R52.2 U8.40(PMIC_STBY_REQ)
NetR54_2: R54.2 U8.42(SDA)
NetR55_2: R55.2 R106.2 U8.28(WDOG_B)
NetR111_1: R111.1 U8.6(RTC_RESET_B)
NetR114_1: R114.1 U8.9(POR_B)
NetR127_2: R127.2 U8.8(PMIC_RST_B)
NetR195_1: R195.1 U8.30(R_SNSP3_CFG)
NetR200_2: R200.2 R202.2 U8.24(SDAH)
NetR201_2: R201.2 R203.2 U8.25(SCLH)

Not connected (* = marked no-connect by the designer): U8 31(LX3_1)* 32(LX3_2)*

### Notes on the sheet
- SYS PMIC
- 0.85/0.95V 3A
- 1.8V 10mA
- 0.8V 10mA
- 0.85/0.95/1.0V 3A
- Sense from processor power pins
- 1.8V 300mA
- 1.2V 200mA
- (near C365) 3.3V/1.8V 150mA
- (near TP25) 3.3V 3A
- (near TP26) 1.8V 2A
- GND Testpoints
- Backup PWR Supply
- (near TP27) 1.1V 2A
- SEQ
- i.MX8M Nano LPDDR4 EVK Power Sequence
- PWR/Signal
- REG
- MIN
- TYP
- MAX
- Max Current(mA)
- # System Reset Button
- # CPU WDOG_B Reset
- OD
- PU
- 1
  2
  3
  4
  5
  6
  6
  7
  8
  9
  9
  10
  11
- NVCC_SNVS_1V8
  VDD_SNVS_0V8
  RTC_RESET_B
  CLK_32K_OUT
  VDD_SOC&DRAM&PU_0V9
  VDD_ARM_0V9
  VDDA_1V8
  VDD_1V8/NVCC_1V8
  NVCC_DRAM_1V1
  VDD_3V3/NVCC_3V3
  NVCC_SD2
  POR_B
  VDD_PHY_1V2
- LDO1
  LDO2
  RTC_RESET_B
  RTC_CLK
  BUCK1
  BUCK2
  LDO3
  BUCK5
  BUCK6
  BUCK4
  LDO5
  POR_B
  LDO4
- 1.62
  0.76
  --
  --
  0.78/0.805
  0.805/0.9/0.95
  1.71
  1.65
  1.06
  3
  3.0/1.65
  --
  1.14
- 1.8
  0.8
  --
  --
  0.82/0.85
  0.85/0.95/1.0
  1.8
  1.8
  1.1
  3.3
  3.3/1.8
  --
  1.2
- 1.98
  0.9
  --
  --
  0.9
  0.95/1.0/1.05
  1.89
  1.95
  1.14
  3.6
  3.6/1.95
  --
  1.26
- 10
  10
  --
  --
  3000
  3000
  300
  2000
  2000
  3000
  150
  --
  150
- When using Base Board, DNP R198/R199/R200/R201, polulate R130/R131
  When using Audio board V2, polulate R198/R199/R200/R201,
  DNP R130/R131.
- 1. WDOG_B is used as Cold Reset, external pull up is needed. On EVK, R106 is not necessary, since WDOG_B/GPIO1_IO02 of CPU has internal pull up.
- Note:
- 2. PMIC_nINT is ppen drain output, external pull up is needed. On EVK, R61 is not necessary, since PMIC_nINT/GPIO1_IO03 of CPU has internal pull up.
- 3. AGND/BUCK_AGND should be connected to ground plane through Via. Do not short to EP directly on top layer
- (in symbol TitleBlock_MCPG) Microcontroller Product Group; 6501 William Cannon Drive West / Austin, TX 78735-8598; This document contains information proprietary to NXP and shall not be used for engineering design,; procurement or manufacture in whole or in part without the express written permission of NXP Semiconductors.; ICAP Classification:; CP:; IUO:; PUBI:; Designer:; Drawing Title:; Drawn by:; Page Title:; Approved:; Size; Document Number; Rev; Date:; Sheet; of

### Library data of the parts
*#4 = TitleBlock_MCPG: as *#2 on sheet Page03 PWR TREE; Page Create Date: March  8, 1995; DrawnBy: Mac Zhang; FCP: ___; Page Modify Date: *
C13 C453 = CAP_NP: CAP CER 4.7uF 10V 10% X5R 0402; CLASS: DISCRETE; FPLIST: CC0402_25,CC0402_HD,0402_CC; CAD_APPROVED: Yes; MFG_PN01: CL05A475KP5NRNC; MFG_NAME01: Samsung Electro Mechanics; AGILE_PN: 150-80044; HEIGHT: 0.65MM; ROHS: Yes; Tolerance: 10%; PCB Footprint: 0402_CC
C272 C365 = CAP_NP: CAP CER 1uF 10V 10% X7S 0402; CLASS: DISCRETE; VOLTAGE: 10; FPLIST: CC0402_25,CC0402_HD,0402_CC; CAD_APPROVED: Yes; MFG_PN01: GRM155C71A105KE11D; MFG_NAME01: MURATA; AGILE_PN: 150-80357; Temp_Range: -55C - 125C; HEIGHT: 0.6MM; ROHS: Yes; Tolerance: 10%; PCB Footprint: 0402_CC; Package Size: 0402; Temp Range: -55C - 125C
C273 = CAP_NP: CAP CER 1uF 10V 10% X7S 0402; CLASS: DISCRETE; FPLIST: CC0402_25,CC0402_HD,0402_CC; CAD_APPROVED: Yes; MFG_PN01: GRM155C71A105KE11D; MFG_NAME01: MURATA; AGILE_PN: 150-80357; Temp_Range: -55C - 125C; HEIGHT: 0.6MM; ROHS: Yes; Tolerance: 10%; PCB Footprint: 0402_CC; Package Size: 0402; Temp Range: -55C - 125C
C274 = CAP_NP: CAP CER 1uF 6.3V 20% X5R 0201; CLASS: DISCRETE; AGILE_PN: 150-79407; MFG_NAME01: AVX; MFG_PN01: 02016D105MAT2A; CAD_APPROVED: Yes; FPLIST: CC0201,CC0201_HD,0201_CC,0201_CC_012SM_NSP; Tolerance: 20%; ROHS: Yes; HEIGHT: 0.35MM; PCB Footprint: 0201_CC; Package Size: 0201; Package Type: 7¡± reel
C275 C283 = CAP_NP: CAP CER 22uF 10V 20% X5R 0603; CLASS: DISCRETE; SIGNAL_MODEL: DEFAULT_CAPACITOR_2.2e+07pF_2_1; FPLIST: CC0603_OV,CC0603,0603_CC; CAD_APPROVED: Yes; MFG_PN01: C1608X5R1A226M080AC; MFG_NAME01: TDK; AGILE_PN: 150-79530; WVDC: 6.3V; HEIGHT: 1MM; ROHS: Yes; Tolerance: 20%; PCB Footprint: CC0603; Package Size: 0603
C276 = CAP_NP: CAP CER 1uF 10V 10% X7S 0402; CLASS: DISCRETE; Temp_Range: -55C - 125C; AGILE_PN: 150-80357; MFG_NAME01: MURATA; MFG_PN01: GRM155C71A105KE11D; CAD_APPROVED: Yes; FPLIST: CC0402_25,CC0402_HD,0402_CC; Tolerance: 10%; ROHS: Yes; HEIGHT: 0.6MM; PCB Footprint: 0402_CC; Package Size: 0402; Temp Range: -55C - 125C
C279 C281 = CAP_NP: CAP CER 10.0uF 16V 10% X5R 0603; CLASS: DISCRETE; FPLIST: CC0603_OV,CC0603,0603_CC,cc0603_0805_nsp; CAD_APPROVED: Yes; Temp_Range: -55¡ãC to +85¡ãC; MFG_PN01: GRM188R61C106KAALD; MFG_NAME01: MURATA; AGILE_PN: 150-80060; HEIGHT: 0.9MM; ROHS: Yes; Tolerance: 10%; PCB Footprint: CC0603; Package Size: 0603; Package Type: SMT; Temp Range: -55¡ãC to +85¡ãC
C285 C311 C317 C318 = CAP_NP: CAP CER 22uF 10V 20% X5R 0603; CLASS: DISCRETE; FPLIST: CC0603_OV,CC0603,0603_CC; CAD_APPROVED: Yes; MFG_PN01: C1608X5R1A226M080AC; MFG_NAME01: TDK; AGILE_PN: 150-79530; WVDC: 6.3V; SIGNAL_MODEL: DEFAULT_CAPACITOR_2.2e+07pF_2_1; HEIGHT: 1MM; ROHS: Yes; Tolerance: 20%; PCB Footprint: CC0603; Package Size: 0603
C287 = CAP_NP: CAP CER 22uF 10V 20% X5R 0603; CLASS: DISCRETE; SIGNAL_MODEL: DEFAULT_CAPACITOR_2.2e+07pF_2_1; WVDC: 6.3V; AGILE_PN: 150-79530; MFG_NAME01: TDK; MFG_PN01: C1608X5R1A226M080AC; CAD_APPROVED: Yes; FPLIST: CC0603_OV,CC0603,0603_CC; Tolerance: 20%; ROHS: Yes; HEIGHT: 1MM; PCB Footprint: CC0603; Package Size: 0603
C295 C301 = CAP_NP: CAP CER 10.0uF 16V 10% X5R 0603; CLASS: DISCRETE; AGILE_PN: 150-80060; MFG_NAME01: MURATA; MFG_PN01: GRM188R61C106KAALD; Temp_Range: -55¡ãC to +85¡ãC; CAD_APPROVED: Yes; FPLIST: CC0603_OV,CC0603,0603_CC,cc0603_0805_nsp; Tolerance: 10%; ROHS: Yes; HEIGHT: 0.9MM; PCB Footprint: CC0603; Package Size: 0603; Package Type: SMT; Temp Range: -55¡ãC to +85¡ãC
C298 = CAP_NP: CAP CER 18pF 50V 5% C0G 0201; CLASS: DISCRETE; FPLIST: CC0201,CC0201_HD,0201_CC; CAD_APPROVED: Yes; MFG_PN01: GRM0335C1H180JA01D; MFG_NAME01: MURATA; AGILE_PN: 150-79476; HEIGHT: 0.33MM; ROHS: Yes; Tolerance: 5%; PCB Footprint: 0201_CC; Package Size: 0201; Package Type: &#966;180mm Paper taping
C299 = CAP_NP: CAP CER 18pF 50V 5% C0G 0201; CLASS: DISCRETE; AGILE_PN: 150-79476; MFG_NAME01: MURATA; MFG_PN01: GRM0335C1H180JA01D; CAD_APPROVED: Yes; FPLIST: CC0201,CC0201_HD,0201_CC; Tolerance: 5%; ROHS: Yes; HEIGHT: 0.33MM; PCB Footprint: 0201_CC; Package Size: 0201; Package Type: &#966;180mm Paper taping
C302 = CAP_NP: as C141 on sheet Page10 WIFI&Bluetooth; PCB Footprint: 0402_CC; Tolerance: 10%; ROHS: Yes; HEIGHT: 0.65MM
C333 C337 = CAP_NP: as C140 on sheet Page10 WIFI&Bluetooth; HEIGHT: 0.35MM; ROHS: Yes; Tolerance: 20%; PCB Footprint: 0201_CC; Package Size: 0201; Package Type: 7¡± reel
C351 = CAP_NP: CAP CER 1uF 10V 10% X7S 0402; CLASS: DISCRETE; Temp_Range: -55C - 125C; AGILE_PN: 150-80357; MFG_NAME01: MURATA; MFG_PN01: GRM155C71A105KE11D; CAD_APPROVED: Yes; FPLIST: CC0402_25,CC0402_HD,0402_CC; VOLTAGE: 10; Tolerance: 10%; ROHS: Yes; HEIGHT: 0.6MM; PCB Footprint: 0402_CC; Package Size: 0402; Temp Range: -55C - 125C
C363 = CAP_NP: CAP CER 2.2uF 10V 10% X5R 0402; CLASS: DISCRETE; AGILE_PN: 150-78974; MFG_NAME01: TDK; MFG_PN01: C1005X5R1A225K; CAD_APPROVED: Yes; FPLIST: CC0402_25,CC0402_HD,0402_CC; Tolerance: 10%; ROHS: Yes; HEIGHT: 0.55 MM; PCB Footprint: 0402_CC; Package Size: 0402
J6 = CONN_HDR_2X1: HDR 1X2 TH 100MIL SP 339H AU 98L; CLASS: IO; FPLIST: HDR102,SH_HDR102_BOTTOM; CAD_APPROVED: YES; Temp_Range: -55¡ãC to +125¡ãC; MFG_PN01: TSW-102-07-G-S; MFG_NAME01: SAMTEC; AGILE_PN: 210-75439; PCB Footprint: HDR_1X2; HEIGHT: 8.71 MM; ROHS: Yes; Temp Range: -55¡ãC to +125¡ãC
L5 L6 L15 = INDUCTOR: IND PWR 0.47uH@1MHZ 4.7A 20% SMT; PART_TYPE: INDUCTOR\POWER; CLASS: DISCRETE; AGILE_PN: 180-78647; MFG_NAME01: SHENZHEN SUNLORD ELECTRONICS CO., LTD; MFG_PN01: WPN252012ER47MT; Temp_Range: -40¡ãC to +125¡ãC; CAD_APPROVED: Yes; PCB Footprint: ind_sph2520; TOL: 20%; ROHS: Yes; HEIGHT: 1.2MM; Tolerance: 20%; Temp Range: -40¡ãC to +125¡ãC
L11 = INDUCTOR: IND PWR 0.47uH@1MHZ 4.7A 20% SMT; PART_TYPE: INDUCTOR\POWER; CLASS: DISCRETE; CAD_APPROVED: Yes; Temp_Range: -40¡ãC to +125¡ãC; MFG_PN01: WPN252012ER47MT; MFG_NAME01: SHENZHEN SUNLORD ELECTRONICS CO., LTD; AGILE_PN: 180-78647; PCB Footprint: ind_sph2520; HEIGHT: 1.2MM; ROHS: Yes; TOL: 20%; Tolerance: 20%; Temp Range: -40¡ãC to +125¡ãC
L13 = INDUCTOR: IND WW 0.47uH@1MHz 3.4A 20% 2016; CLASS: DISCRETE; AGILE_PN: 180-78630; MFG_NAME01: MURATA; MFG_PN01: 1286AS-H-R47M=P2; Temp_Range: -40C to +85C; CAD_APPROVED: Yes; VOLTAGE: 20V DC; PCB Footprint: IND_2016A; Tolerance: 20%; ROHS: Yes; HEIGHT: 1.2MM; PART_TYPE: INDUCTOR; Temp Range: -40C to +85C
QZ2 = XTAL: XTAL 32.768KHZ 12.5PF 20PPM 3.2X1.5MM SMT; CLASS: IC; CAD_APPROVED: Yes; MFG_PN01: ABS07-32.768KHZ-T; MFG_NAME01: Abracon Corporation; AGILE_PN: 230-77653; PCB Footprint: XTAL2-3P2X1P5-SM; HEIGHT: 0.9MM; ROHS: Yes
R48 R54 R55 R191 R192 R194 R198 R199 R202 = RES: RES MF ZERO OHM 1/16W 5% 0402; CLASS: DISCRETE; FPLIST: RC0402_25,RC0402_HD,RC0402_X2,0402_CC; CAD_APPROVED: Yes; MFG_PN01: MCR01MZPJ000; MFG_NAME01: ROHM; AGILE_PN: 470-75394; HEIGHT: 0.45 MM; ROHS: Yes; Tolerance: 5%; PCB Footprint: 0402_CC; VOLTAGE: 1/16W
R51 = RES: RES MF ZERO OHM 1/16W 5% 0402; CLASS: DISCRETE; CAD_APPROVED: Yes; MFG_PN01: MCR01MZPJ000; MFG_NAME01: ROHM; AGILE_PN: 470-75394; HEIGHT: 0.45 MM; ROHS: Yes; Tolerance: 5%; PCB Footprint: 0402_CC; VOLTAGE: 1/16W
R52 R127 R193 R195 R203 = RES: RES MF ZERO OHM 1/16W 5% 0402; CLASS: DISCRETE; AGILE_PN: 470-75394; MFG_NAME01: ROHM; MFG_PN01: MCR01MZPJ000; CAD_APPROVED: Yes; FPLIST: RC0402_25,RC0402_HD,RC0402_X2,0402_CC; Tolerance: 5%; ROHS: Yes; HEIGHT: 0.45 MM; PCB Footprint: 0402_CC; VOLTAGE: 1/16W
R61 = RES: RES MF 100K 1/20W 1% 0201; CLASS: DISCRETE; AGILE_PN: 470-77704; MFG_NAME01: SKYMOS; MFG_PN01: RC-0201-104FT; CAD_APPROVED: Yes; FPLIST: RC0201,0201_CC; Tolerance: 1%; ROHS: Yes; HEIGHT: 0.26MM; PCB Footprint: 0201_CC
R106 = RES: RES MF 100K 1/20W 1% 0201; CLASS: DISCRETE; FPLIST: RC0201,0201_CC; CAD_APPROVED: Yes; MFG_PN01: RC-0201-104FT; MFG_NAME01: SKYMOS; AGILE_PN: 470-77704; HEIGHT: 0.26MM; ROHS: Yes; Tolerance: 1%; PCB Footprint: 0201_CC
R111 = RES: RES MF ZERO OHM 1/16W 5% 0402; CLASS: DISCRETE; AGILE_PN: 470-75394; MFG_NAME01: ROHM; MFG_PN01: MCR01MZPJ000; CAD_APPROVED: Yes; TOL: 1%; SIGNAL_MODEL: DEFAULT_RESISTOR_10000OHM_2_1; Tolerance: 5%; ROHS: Yes; HEIGHT: 0.45 MM; PCB Footprint: 0402_CC; VOLTAGE: 1/16W
R114 R137 = RES: as R44 on sheet Page10 WIFI&Bluetooth; Tolerance: 5%; ROHS: Yes; HEIGHT: 0.45 MM; PCB Footprint: 0402_CC; VOLTAGE: 1/16W
R196 R197 R201 = RES: RES MF 4.7K 1/20W 5% AEC-Q200 0201; CLASS: DISCRETE; FPLIST: RC0201,0201_CC; CAD_APPROVED: Yes; Temp_Range: -55C to +155C; MFG_PN01: RK73B1HTTC472J; MFG_NAME01: KOA SPEER; AGILE_PN: 470-79700; PCB Footprint: 0201_CC; HEIGHT: 0.25MM; ROHS: Yes; Tolerance: 5%; Temp Range: -55C to +155C
R200 = RES: RES MF 4.7K 1/20W 5% AEC-Q200 0201; CLASS: DISCRETE; AGILE_PN: 470-79700; MFG_NAME01: KOA SPEER; MFG_PN01: RK73B1HTTC472J; Temp_Range: -55C to +155C; CAD_APPROVED: Yes; FPLIST: RC0201,0201_CC; Tolerance: 5%; ROHS: Yes; HEIGHT: 0.25MM; PCB Footprint: 0201_CC; Temp Range: -55C to +155C
TP22 TP25-TP27 TP65 = T POINT R: TEST POINT PAD .035 SMT, no part to order; ASSY_OPT: DNP; CLASS: IC; AGILE_PN: 510-75618; CAD_APPROVED: Yes; ROHS: Yes; HEIGHT: 0.1MM; PCB Footprint: testpoint_35mil
TP23 TP28 TP29 TP31-TP33 TP53 = T POINT R: TEST POINT PAD .035 SMT, no part to order; ASSY_OPT: DNP; CLASS: IC; CAD_APPROVED: Yes; AGILE_PN: 510-75618; HEIGHT: 0.1MM; ROHS: Yes; PCB Footprint: testpoint_35mil
TP44 TP45 TP47 = TESTLOOP: TEST POINT PAD 50MIL DIA SMT, NO PART TO ORDER; CLASS: IO; ASSY_OPT: DNP; CAD_APPROVED: Yes; MFG_PN01: NOTACOMPONENT; AGILE_PN: 211-76644; PCB Footprint: TPAD_050; HEIGHT: 0.1MM; ROHS: Yes; MFG_NAME01: NOTACOMPONENT
TP46 = TESTLOOP: TEST POINT PAD 50MIL DIA SMT, NO PART TO ORDER; CLASS: IO; ASSY_OPT: DNP; AGILE_PN: 211-76644; MFG_NAME01: NOTACOMPONENT; CAD_APPROVED: Yes; PCB Footprint: TPAD_050; MFG_PN01: NOTACOMPONENT; ROHS: Yes; HEIGHT: 0.1MM
U8 = PCA9450_HVQFN56P_A: IC POWER MANAGEMENT 2.7-5.5V HVQFN56; SPLIT_INST: TRUE; SWAP_INFO: (S1+S2+S3); CAD_APPROVED: Yes; PRE_APN: 315-82314; Temp_Range: -40C to +105C; MFG_NAME01: NXP SEMICONDUCTORS; AGILE_PN: TMP-WF-36197; CLASS: IC; PCB Footprint: hvqfn56_0p4_7x7_ep4p7mm; HEIGHT: 1MM; ROHS: Yes; MFG_PN01: PCA9450BHN; VOLTAGE: 2.7-5.5V; Temp Range: -40C to +105C

## Sheet Page09 eMMC_QSPI.SchDoc
size 386 x 246 mm
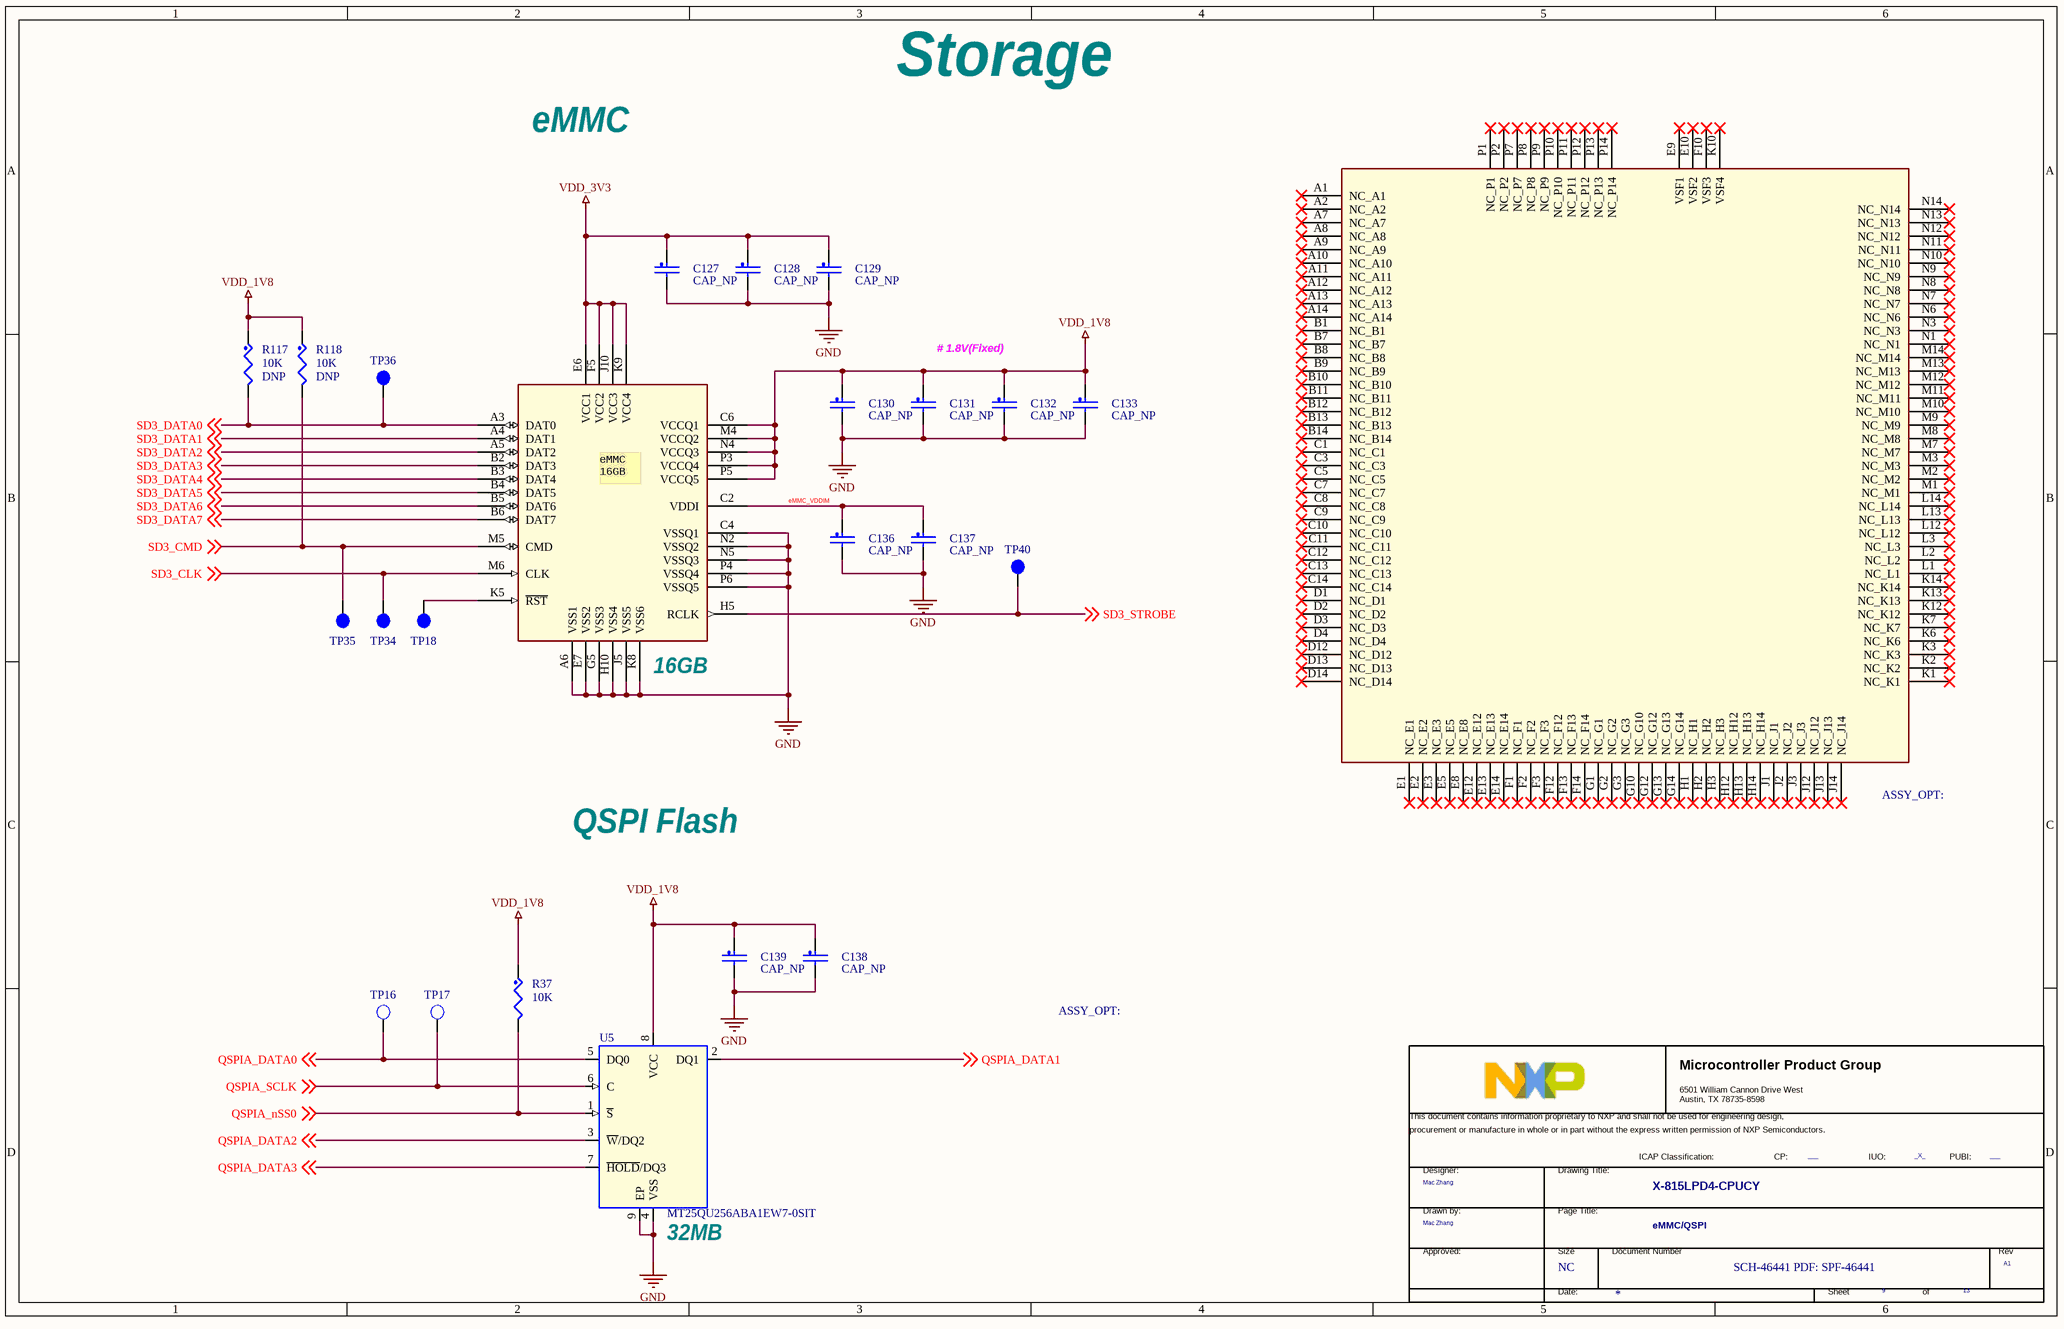
[diagram p6: Page09 eMMC_QSPI.SchDoc]

### Parts
(Parts that share a designator on the sheet are numbered #1, #2 ... from top to bottom, then left to right.)
*#5  Doc: SCH-46441 PDF: SPF-46441  RevCode: A1  Title: X-815LPD4-CPUCY  Page Size: NC  Page Number: 9  Page Count: 13  PageTitle: eMMC/QSPI  Designer: Mac Zhang  PUBI: ___  FIUO: _X_  (hidden comment: TitleBlock_MCPG)  (graphical)
C127  CAP_NP  [RC0402]
C128  CAP_NP  [RC0402]
C129  CAP_NP  [RC0402]
C130  CAP_NP  [RC0402]
C131  CAP_NP  [RC0402]
C132  CAP_NP  [RC0402]
C133  CAP_NP  [RC0402]
C136  CAP_NP  [RC0402]
C137  CAP_NP  [RC0402]
C138  CAP_NP  [RC0402]
C139  CAP_NP  [RC0402]
R37  10K  [0402_CC]
R117  10K  ASSY_OPT: DNP  [0201_CC]
R118  10K  ASSY_OPT: DNP  [0201_CC]
TP16  TP_35MIL  [testpoint_35mil]  (value not drawn)
TP17  TP_35MIL  [testpoint_35mil]  (value not drawn)
TP18  tpad_020  [tpad_020]  (value not drawn)
TP34  tpad_020  [tpad_020]  (value not drawn)
TP35  TPAD_015  [TPAD_015]  (value not drawn)
TP36  tpad_020  [tpad_020]  (value not drawn)
TP40  TPAD_015  [TPAD_015]  (value not drawn)
U4  SDINBDG4-16G_VFBGA_153P  [BGA153N50P14X14_1300X1150X80]  (value not drawn)  (parts A,B of 2)
U5  MT25QU256ABA1EW7-0SIT  [dfn8_1p27_6x5mm_3p1]

### Nets
GND: C127.2 C128.2 C129.2 C130.2 C131.2 C132.2 C133.2 C136.2 C137.2 C138.2 C139.2 U4.A6(VSS1) U4.C4(VSSQ1) U4.E7(VSS2) U4.G5(VSS3) U4.H10(VSS4) U4.J5(VSS5) U4.K8(VSS6) U4.N2(VSSQ2) U4.N5(VSSQ3) U4.P4(VSSQ4) U4.P6(VSSQ5) U5.4(VSS) U5.9(EP)
VDD_1V8: C130.1 C131.1 C132.1 C133.1 C138.1 C139.1 R37.1 R117.1 R118.1 U4.C6(VCCQ1) U4.M4(VCCQ2) U4.N4(VCCQ3) U4.P3(VCCQ4) U4.P5(VCCQ5) U5.8(VCC)
VDD_3V3: C127.1 C128.1 C129.1 U4.E6(VCC1) U4.F5(VCC2) U4.J10(VCC3) U4.K9(VCC4)
eMMC_VDDIM: C136.1 C137.1 U4.C2(VDDI)
QSPIA_DATA0: TP16.1(TP) U5.5(DQ0) ; off-sheet QSPIA_DATA0
QSPIA_DATA1: U5.2(DQ1) ; off-sheet QSPIA_DATA1
QSPIA_DATA2: U5.3(~{W}/DQ2) ; off-sheet QSPIA_DATA2
QSPIA_DATA3: U5.7(~{HOLD}/DQ3) ; off-sheet QSPIA_DATA3
QSPIA_nSS0: R37.2 U5.1(~{S}) ; off-sheet QSPIA_nSS0
QSPIA_SCLK: TP17.1(TP) U5.6(C) ; off-sheet QSPIA_SCLK
SD3_CLK: TP34.1(Pin1) U4.M6(CLK) ; off-sheet SD3_CLK
SD3_CMD: R118.2 TP35.1(Pin1) U4.M5(CMD) ; off-sheet SD3_CMD
SD3_DATA0: R117.2 TP36.1(Pin1) U4.A3(DAT0) ; off-sheet SD3_DATA0
SD3_DATA1: U4.A4(DAT1) ; off-sheet SD3_DATA1
SD3_DATA2: U4.A5(DAT2) ; off-sheet SD3_DATA2
SD3_DATA3: U4.B2(DAT3) ; off-sheet SD3_DATA3
SD3_DATA4: U4.B3(DAT4) ; off-sheet SD3_DATA4
SD3_DATA5: U4.B4(DAT5) ; off-sheet SD3_DATA5
SD3_DATA6: U4.B5(DAT6) ; off-sheet SD3_DATA6
SD3_DATA7: U4.B6(DAT7) ; off-sheet SD3_DATA7
SD3_STROBE: TP40.1(Pin1) U4.H5(RCLK) ; off-sheet SD3_STROBE
NetTP18_1: TP18.1(Pin1) U4.K5(~{RST})

Not connected (* = marked no-connect by the designer): U4 A1(NC_A1)* A2(NC_A2)* A7(NC_A7)* A8(NC_A8)* A9(NC_A9)* A10(NC_A10)* A11(NC_A11)* A12(NC_A12)* A13(NC_A13)* A14(NC_A14)* B1(NC_B1)* B7(NC_B7)* B8(NC_B8)* B9(NC_B9)* B10(NC_B10)* B11(NC_B11)* B12(NC_B12)* B13(NC_B13)* B14(NC_B14)* C1(NC_C1)* C3(NC_C3)* C5(NC_C5)* C7(NC_C7)* C8(NC_C8)* C9(NC_C9)* C10(NC_C10)* C11(NC_C11)* C12(NC_C12)* C13(NC_C13)* C14(NC_C14)* D1(NC_D1)* D2(NC_D2)* D3(NC_D3)* D4(NC_D4)* D12(NC_D12)* D13(NC_D13)* D14(NC_D14)* E1(NC_E1)* E2(NC_E2)* E3(NC_E3)* E5(NC_E5)* E8(NC_E8)* E9(VSF1)* E10(VSF2)* E12(NC_E12)* E13(NC_E13)* E14(NC_E14)* F1(NC_F1)* F2(NC_F2)* F3(NC_F3)* F10(VSF3)* F12(NC_F12)* F13(NC_F13)* F14(NC_F14)* G1(NC_G1)* G2(NC_G2)* G3(NC_G3)* G10(NC_G10)* G12(NC_G12)* G13(NC_G13)* G14(NC_G14)* H1(NC_H1)* H2(NC_H2)* H3(NC_H3)* H12(NC_H12)* H13(NC_H13)* H14(NC_H14)* J1(NC_J1)* J2(NC_J2)* J3(NC_J3)* J12(NC_J12)* J13(NC_J13)* J14(NC_J14)* K1(NC_K1)* K2(NC_K2)* K3(NC_K3)* K6(NC_K6)* K7(NC_K7)* K10(VSF4)* K12(NC_K12)* K13(NC_K13)* K14(NC_K14)* L1(NC_L1)* L2(NC_L2)* L3(NC_L3)* L12(NC_L12)* L13(NC_L13)* L14(NC_L14)* M1(NC_M1)* M2(NC_M2)* M3(NC_M3)* M7(NC_M7)* M8(NC_M8)* M9(NC_M9)* M10(NC_M10)* M11(NC_M11)* M12(NC_M12)* M13(NC_M13)* M14(NC_M14)* N1(NC_N1)* N3(NC_N3)* N6(NC_N6)* N7(NC_N7)* N8(NC_N8)* N9(NC_N9)* N10(NC_N10)* N11(NC_N11)* N12(NC_N12)* N13(NC_N13)* N14(NC_N14)* P1(NC_P1)* P2(NC_P2)* P7(NC_P7)* P8(NC_P8)* P9(NC_P9)* P10(NC_P10)* P11(NC_P11)* P12(NC_P12)* P13(NC_P13)* P14(NC_P14)*

### Notes on the sheet
- Storage
- eMMC
- # 1.8V(Fixed)
- (near U4) 16GB
- QSPI Flash
- (near U5) 32MB
- (in symbol SDINBDG4-16G_VFBGA_153P, part A) eMMC / 16GB
- (in symbol TitleBlock_MCPG) Microcontroller Product Group; 6501 William Cannon Drive West / Austin, TX 78735-8598; This document contains information proprietary to NXP and shall not be used for engineering design,; procurement or manufacture in whole or in part without the express written permission of NXP Semiconductors.; ICAP Classification:; CP:; IUO:; PUBI:; Designer:; Drawing Title:; Drawn by:; Page Title:; Approved:; Size; Document Number; Rev; Date:; Sheet; of

### Library data of the parts
*#5 = TitleBlock_MCPG: as *#2 on sheet Page03 PWR TREE; Page Create Date: March  8, 1995; DrawnBy: Mac Zhang; FCP: ___; Page Modify Date: *
C127-C133 C136-C139 = CAP_NP: CLASS: DISCRETE
R37 = RES: RES MF 10K 1/16W 5% 0402; CLASS: DISCRETE; AGILE_PN: 470-75557; MFG_NAME01: VISHAY INTERTECHNOLOGY; MFG_PN01: CRCW040210K0JNED; CAD_APPROVED: Yes; FPLIST: RC0402_25,RC0402_HD,0402_CC; HEIGHT: 0.4 MM; Tolerance: 5%; ROHS: Yes; PCB Footprint: 0402_CC
R117 R118 = RES: as R153 on sheet Page10 WIFI&Bluetooth; HEIGHT: 0.26 MM; ROHS: Yes; Tolerance: 5%; PCB Footprint: 0201_CC
TP16 TP17 = T POINT R: as TP23 on sheet Page12 PMIC PCA9450B; HEIGHT: 0.1MM; ROHS: Yes; PCB Footprint: testpoint_35mil
TP18 TP36 = TESTLOOP: TEST POINT PAD 0.5MM DIA SMT, NO PART TO ORDER; CLASS: IO; ASSY_OPT: DNP; AGILE_PN: 211-77484; CAD_APPROVED: Yes; ROHS: Yes; HEIGHT: 0.1MM; PCB Footprint: tpad_020
TP34 = TESTLOOP: TEST POINT PAD 0.5MM DIA SMT, NO PART TO ORDER; CLASS: IO; ASSY_OPT: DNP; CAD_APPROVED: Yes; AGILE_PN: 211-77484; HEIGHT: 0.1MM; ROHS: Yes; PCB Footprint: tpad_020
TP35 = TESTLOOP: as TP11 on sheet Page10 WIFI&Bluetooth; MFG_PN01: NOTACOMPONENT; ROHS: Yes; HEIGHT: 0.1MM; PCB Footprint: TPAD_015
TP40 = TESTLOOP: TEST POINT PAD 15MIL DIA SMT, NO PART TO ORDER; CLASS: IO; AGILE_PN: 211-76645; MFG_NAME01: NOTACOMPONENT; CAD_APPROVED: Yes; MFG_PN01: NOTACOMPONENT; ROHS: Yes; HEIGHT: 0.1MM; PCB Footprint: TPAD_015
U4 = SDINBDG4-16G_VFBGA_153P: CLASS: IC
U5 = MT25QL256ABA1EW9_9P: IC MEM FLASH SERIAL NOR 256MBIT 166MHZ 1.7-2V WPDFN8; AGILE_PN: 334-77688; MFG_NAME01: MICRON; CAD_APPROVED: Yes; CLASS: IC; PCB Footprint: dfn8_1p27_6x5mm_3p1; MFG_PN01: MT25QU256ABA1EW7-0SIT; ROHS: Yes; HEIGHT: 0.8 MM; VOLTAGE: 1.7-2V

## Nets that join several sheets
GND: Page10 WIFI&Bluetooth (40 pins), Page12 PMIC PCA9450B (33 pins), Page09 eMMC_QSPI (24 pins)
VDD_1V8: Page12 PMIC PCA9450B (8 pins), Page09 eMMC_QSPI (15 pins)
VDD_3V3: Page10 WIFI&Bluetooth (5 pins), Page12 PMIC PCA9450B (9 pins), Page09 eMMC_QSPI (7 pins)
SAI2_TXC: Page10 WIFI&Bluetooth (R131.2), Page12 PMIC PCA9450B (R198.1)
SAI2_TXD: Page10 WIFI&Bluetooth (R130.2), Page12 PMIC PCA9450B (R199.1)